# EAGLE schematic cft (EAGLE 5.11), part 4 of 7
## Sheet 29 of 49
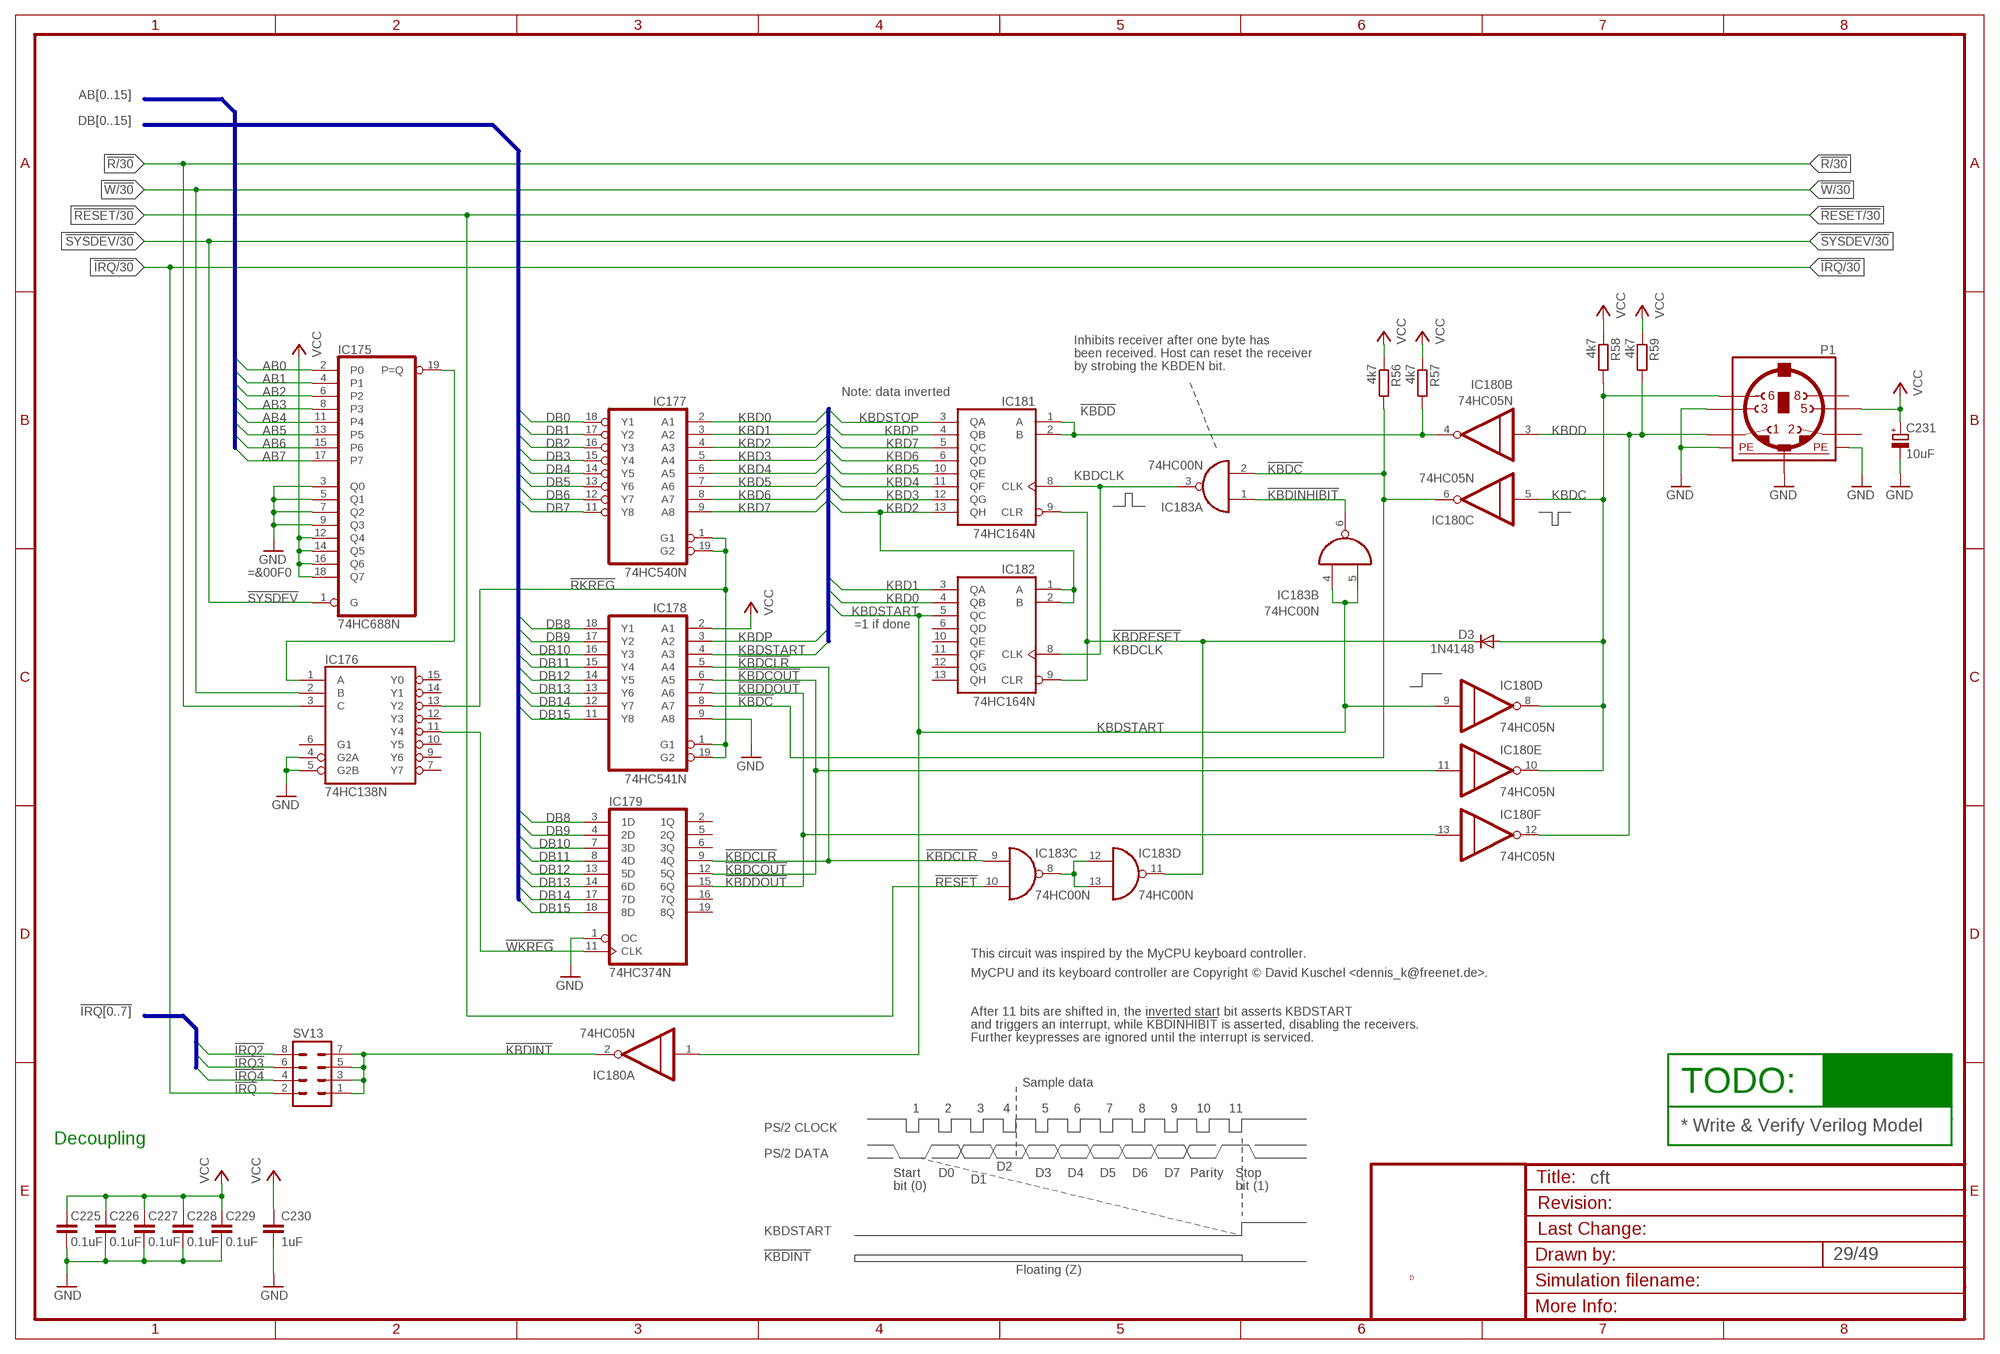
[diagram p28: schematic, sheet 29]

### Parts
C225  0.1uF  C-EU025-024X044  [C025-024X044]
C226  0.1uF  C-EU025-024X044  [C025-024X044]
C227  0.1uF  C-EU025-024X044  [C025-024X044]
C228  0.1uF  C-EU025-024X044  [C025-024X044]
C229  0.1uF  C-EU025-024X044  [C025-024X044]
C230  1uF  C-EU025-024X044  [C025-024X044]
C231  10uF  CPOL-EUE2.5-5  [E2,5-5]
D3  1N4148  1N4148DO35-7  [DO35-7]
IC175  74HC688N  [DIL20]
IC176  74HC138N  [DIL16]
IC177  74HC540N  [DIL20]
IC178  74HC541N  [DIL20]
IC179  74HC374N  [DIL20]
IC180  74HC05N  [DIL14]
IC181  74HC164N  [DIL14]
IC182  74HC164N  [DIL14]
IC183  74HC00N  [DIL14]
P1  MINI_DIN_6  [M_DIN6]
R56  4k7  R-EU_0204/7  [0204/7]
R57  4k7  R-EU_0204/7  [0204/7]
R58  4k7  R-EU_0204/7  [0204/7]
R59  4k7  R-EU_0204/7  [0204/7]
SV13  MA04-2  [MA04-2]

### Nets
!IRQ: SV13.2 ; also sheet 11,22,25,26,27,28,30,44,47
!IRQ2: SV13.8 ; also sheet 22,25,27,30,44,45,46,47
!IRQ3: SV13.6 ; also sheet 22,25,30,44,45,46,47
!IRQ4: SV13.4 ; also sheet 22,25,30,44,45,46,47
!KBDC: IC178.8(A7) IC180.6(C:O) IC183.2(A:I1) R56.2
!KBDCLR: IC178.5(A4) IC179.9(4Q) IC183.9(C:I0)
!KBDCOUT: IC178.6(A5) IC179.12(5Q) IC180.11(E:I)
!KBDD: IC180.4(B:O) IC181.1(A) IC181.2(B) R57.2
!KBDDOUT: IC178.7(A6) IC179.15(6Q) IC180.13(F:I)
!KBDINHIBIT: IC183.1(A:I0) IC183.6(B:O)
!KBDINT: IC180.2(A:O) SV13.1 SV13.3 SV13.5 SV13.7
!KBDRESET: D3.C IC181.9(CLR) IC182.9(CLR) IC183.11(D:O)
!R: IC176.3(C) ; also sheet 4,5,6,12,22,24,25,26,27,28,30,41,42,44,45,46,47,48
!RESET: IC183.10(C:I1) ; also sheet 2,3,4,7,8,10,11,12,13,14,17,18,19,20,21,22,25,26,28,30,31,44,45,46,47
!RKREG: IC176.13(Y2) IC177.1(G1) IC177.19(G2) IC178.1(G1) IC178.19(G2)
!SYSDEV: IC175.1(G) ; also sheet 13,21,22,25,26,27,28,30,41,44,45,46
!W: IC176.2(B) ; also sheet 12,21,22,24,25,26,27,28,30,41,44,45,46,47,48
!WKREG: IC176.11(Y4) IC179.11(CLK)
AB0: IC175.2(P0) ; also sheet 13,21,24,25,26,27,28,30,41,44,45,46,47,48
AB1: IC175.4(P1) ; also sheet 13,21,24,25,26,27,28,30,41,44,45,46,47,48
AB2: IC175.6(P2) ; also sheet 13,21,24,25,26,27,30,41,44,45,46,47,48
AB3: IC175.8(P3) ; also sheet 13,24,25,26,27,28,30,41,44,45,46,47,48
AB4: IC175.11(P4) ; also sheet 13,22,24,25,26,27,28,30,41,44,45,46,47,48
AB5: IC175.13(P5) ; also sheet 13,21,22,24,25,26,27,28,30,41,44,45,46,47,48
AB6: IC175.15(P6) ; also sheet 13,21,22,24,25,26,27,28,30,41,44,45,46,47,48
AB7: IC175.17(P7) ; also sheet 13,21,22,24,25,26,27,28,30,41,44,45,46,47,48
DB0: IC177.18(Y1) ; also sheet 12,21,22,24,25,26,27,28,30,31,41,44,45,46,47,48
DB1: IC177.17(Y2) ; also sheet 12,21,22,24,25,26,27,28,30,31,41,44,45,46,47,48
DB2: IC177.16(Y3) ; also sheet 12,21,22,24,25,26,27,28,30,31,41,44,45,46,47,48
DB3: IC177.15(Y4) ; also sheet 12,21,22,24,25,26,27,28,30,31,41,44,45,46,47,48
DB4: IC177.14(Y5) ; also sheet 12,21,22,24,25,26,27,28,30,31,41,44,45,46,47,48
DB5: IC177.13(Y6) ; also sheet 12,21,22,24,25,26,27,28,30,31,41,44,45,46,47,48
DB6: IC177.12(Y7) ; also sheet 12,21,22,24,25,26,27,28,30,31,41,44,45,46,47,48
DB7: IC177.11(Y8) ; also sheet 12,21,22,24,25,26,27,28,30,31,41,44,45,46,47,48
DB8: IC178.18(Y1) IC179.3(1D) ; also sheet 12,21,24,26,27,30,31,41,44,45,46,48
DB9: IC178.17(Y2) IC179.4(2D) ; also sheet 12,24,26,27,30,41,44,45,46,48
DB10: IC178.16(Y3) IC179.7(3D) ; also sheet 12,24,26,27,30,41,44,45,46,48
DB11: IC178.15(Y4) IC179.8(4D) ; also sheet 12,24,26,27,30,41,44,45,46,48
DB12: IC178.14(Y5) IC179.13(5D) ; also sheet 12,24,26,27,30,41,44,45,46,48
DB13: IC178.13(Y6) IC179.14(6D) ; also sheet 12,24,26,27,30,41,44,45,46,48
DB14: IC178.12(Y7) IC179.17(7D) ; also sheet 12,24,26,27,30,41,44,45,46,48
DB15: IC178.11(Y8) IC179.18(8D) ; also sheet 12,24,26,27,30,41,44,45,46,48
GND [low power]: C225.1 C226.1 C227.1 C228.1 C229.1 C230.2 C231.- IC175.3(Q0) IC175.5(Q1) IC175.7(Q2) IC175.9(Q3) IC176.4(G2A) IC176.5(G2B) IC178.9(A8) IC179.1(OC) P1.3 P1.SH1(PE1) P1.SH2(PE2) P1.SH3(PE3) ; also sheet 2,3,4,5,6,7,8,9,10,11,12,13,14,15,16,17,18,19,20,21,22,24,25,26,27,28,30,31,32,33,34,35,36,37,38,39,40,41,42,43,44,45,46,47,48,49
KBD0: IC177.2(A1) IC182.4(QB)
KBD1: IC177.3(A2) IC182.3(QA)
KBD2: IC177.4(A3) IC181.13(QH) IC182.1(A) IC182.2(B)
KBD3: IC177.5(A4) IC181.12(QG)
KBD4: IC177.6(A5) IC181.11(QF)
KBD5: IC177.7(A6) IC181.10(QE)
KBD6: IC177.8(A7) IC181.6(QD)
KBD7: IC177.9(A8) IC181.5(QC)
KBDC: D3.A IC180.5(C:I) IC180.8(D:O) IC180.10(E:O) P1.6 R58.2
KBDCLK: IC181.8(CLK) IC182.8(CLK) IC183.3(A:O)
KBDD: IC180.3(B:I) IC180.12(F:O) P1.1 R59.2
KBDP: IC178.3(A2) IC181.4(QB)
KBDSTART: IC178.4(A3) IC180.1(A:I) IC180.9(D:I) IC182.5(QC) IC183.4(B:I0) IC183.5(B:I1)
KBDSTOP: IC181.3(QA)
N$144: IC183.8(C:O) IC183.12(D:I0) IC183.13(D:I1)
N$145: IC175.19(P=Q) IC176.1(A)
VCC [low power]: C225.2 C226.2 C227.2 C228.2 C229.2 C230.1 C231.+ IC175.12(Q4) IC175.14(Q5) IC175.16(Q6) IC175.18(Q7) IC178.2(A1) P1.5 R56.1 R57.1 R58.1 R59.1 ; also sheet 2,3,4,6,7,8,9,10,11,12,13,14,15,16,17,18,19,20,21,22,24,25,26,27,28,30,31,34,35,36,37,38,39,40,41,42,43,44,45,46,47,48,49
Unconnected: IC176.6(G1) IC176.7(Y7) IC176.9(Y6) IC176.10(Y5) IC176.12(Y3) IC176.14(Y1) IC176.15(Y0) IC179.2(1Q) IC179.5(2Q) IC179.6(3Q) IC179.16(7Q) IC179.19(8Q) IC182.6(QD) IC182.10(QE) IC182.11(QF) IC182.12(QG) IC182.13(QH) P1.2 P1.8

### Buses
DB[0..15]
AB[0..15]
!IRQ[0..7]

### Notes on the sheet
- Inhibits receiver after one byte has
- been received. Host can reset the receiver
- by strobing the KBDEN bit.
- Note: data inverted
- =&00F0
- =1 if done
- This circuit was inspired by the MyCPU keyboard controller.
- MyCPU and its keyboard controller are Copyright © David Kuschel <dennis_k@freenet.de>.
- After 11 bits are shifted in, the inverted start bit asserts KBDSTART
- and triggers an interrupt, while !KBDINHIBIT! is asserted, disabling the receivers.
- Further keypresses are ignored until the interrupt is serviced.
- Sample data
- TODO:
- 1 | 2 | 3 | 4 | 5 | 6 | 7 | 8 | 9 | 10 | 11
- PS/2 CLOCK | * Write & Verify Verilog Model
- Decoupling
- PS/2 DATA
- D2
- Start | D0 | D3 | D4 | D5 | D6 | D7 | Parity | Stop
- D1
- bit (0) | bit (1)
- KBDSTART
- !KBDINT
- Floating (Z)
- D

## Sheet 30 of 49
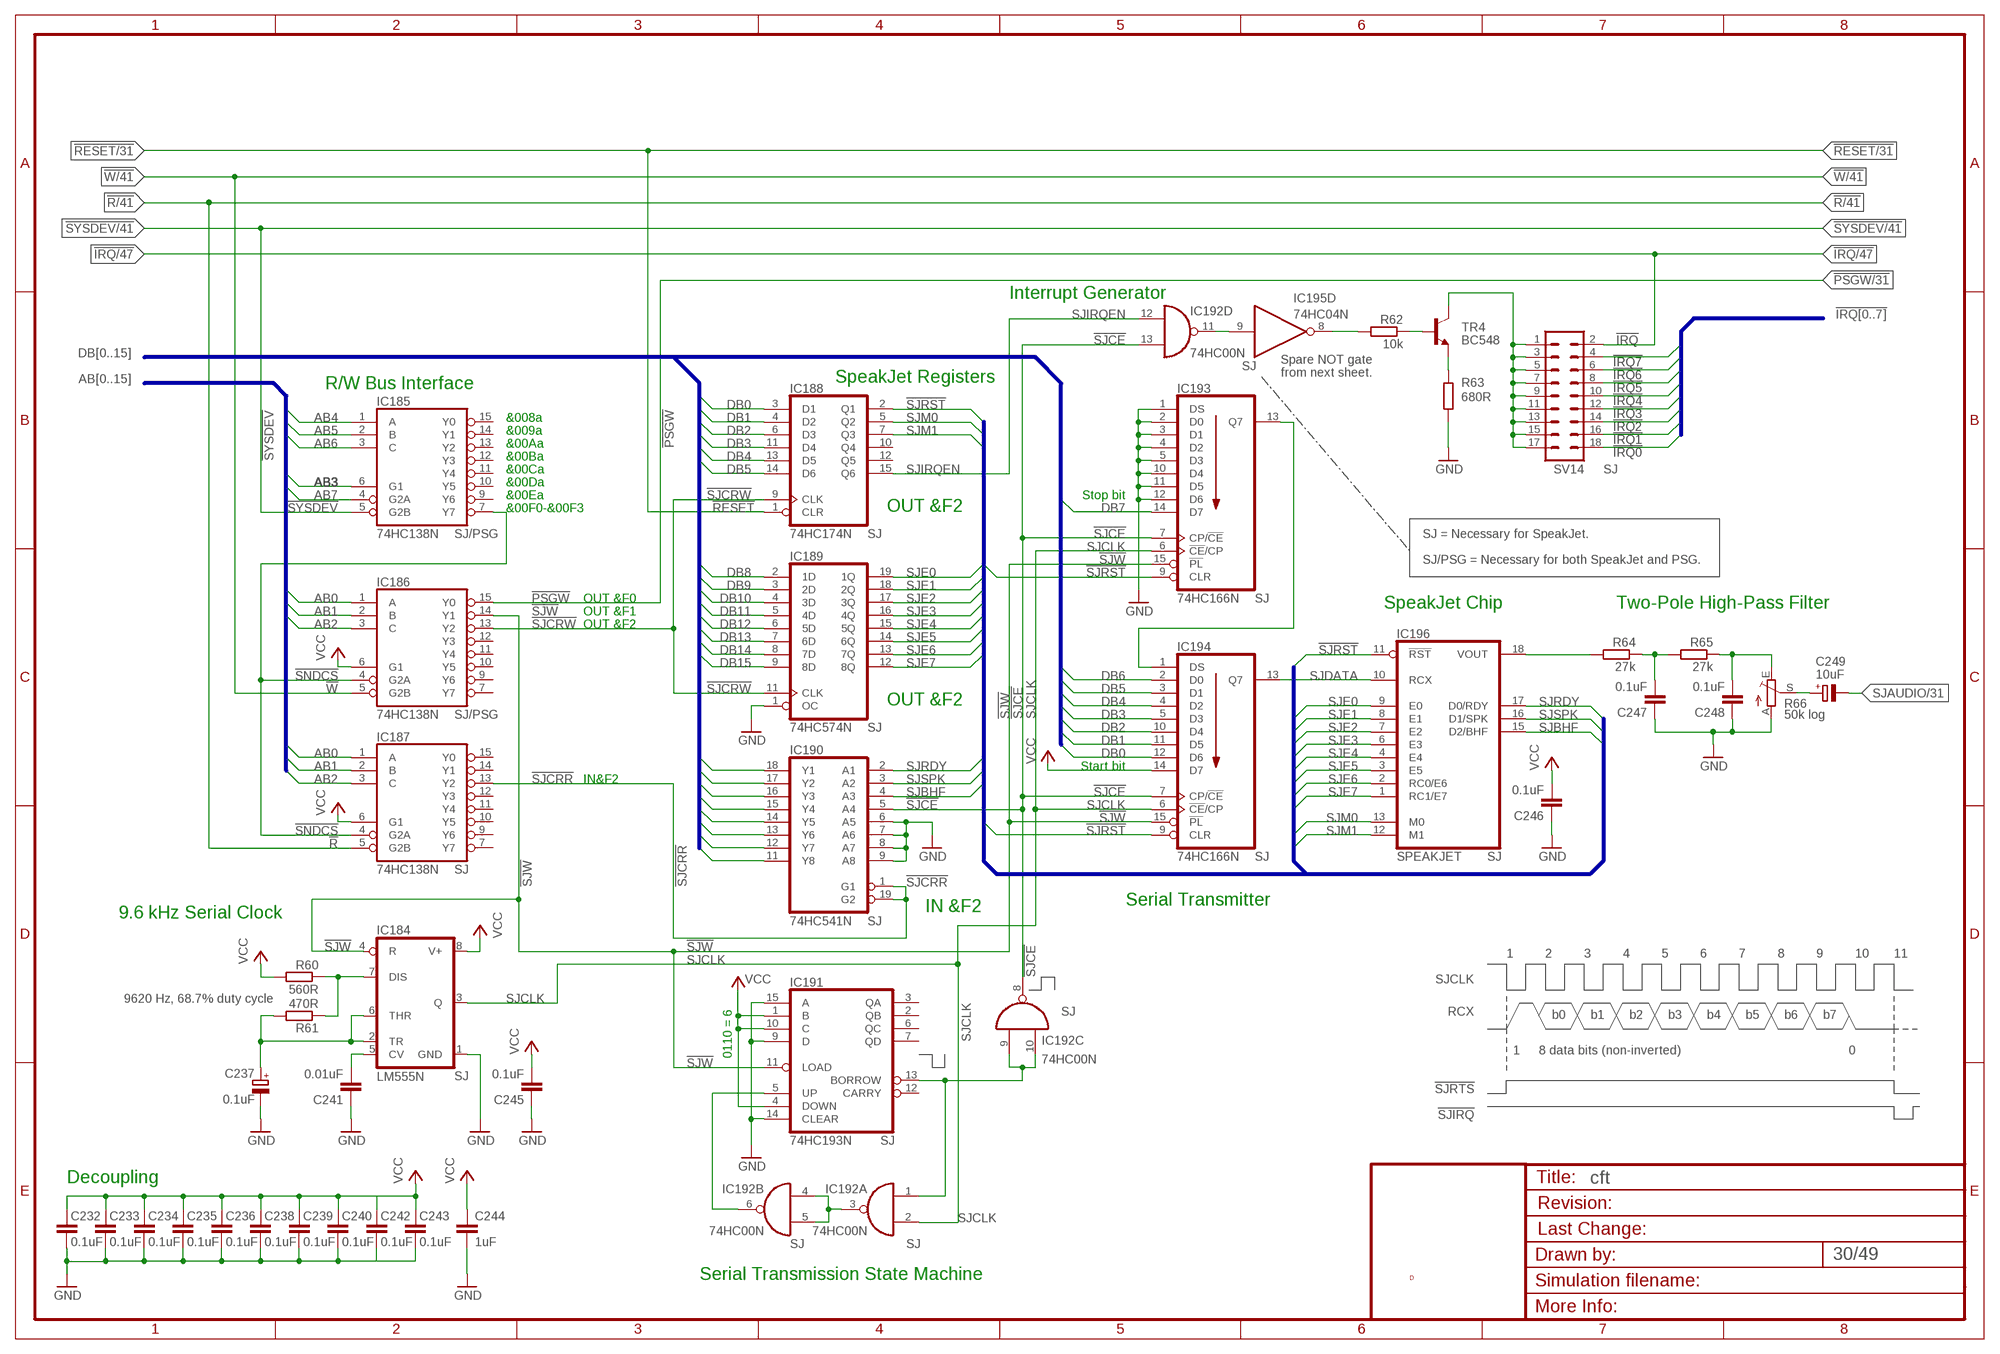
[diagram p29: schematic, sheet 30]

### Parts
C232  0.1uF  C-EU025-024X044  [C025-024X044]
C233  0.1uF  C-EU025-024X044  [C025-024X044]
C234  0.1uF  C-EU025-024X044  [C025-024X044]
C235  0.1uF  C-EU025-024X044  [C025-024X044]
C236  0.1uF  C-EU025-024X044  [C025-024X044]
C237  0.1uF  CPOL-EUE2.5-5  [E2,5-5]
C238  0.1uF  C-EU025-024X044  [C025-024X044]
C239  0.1uF  C-EU025-024X044  [C025-024X044]
C240  0.1uF  C-EU025-024X044  [C025-024X044]
C241  0.01uF  C-EU025-024X044  [C025-024X044]
C242  0.1uF  C-EU025-024X044  [C025-024X044]
C243  0.1uF  C-EU025-024X044  [C025-024X044]
C244  1uF  C-EU025-024X044  [C025-024X044]
C245  0.1uF  C-EU025-024X044  [C025-024X044]
C246  0.1uF  C-EU025-024X044  [C025-024X044]
C247  0.1uF  C-EU025-024X044  [C025-024X044]
C248  0.1uF  C-EU025-024X044  [C025-024X044]
C249  10uF  CPOL-EUE2.5-5  [E2,5-5]
IC184  LM555N  [DIL08]
IC185  74HC138N  [DIL16]
IC186  74HC138N  [DIL16]
IC187  74HC138N  [DIL16]
IC188  74HC174N  [DIL16]
IC189  74HC574N  [DIL20]
IC190  74HC541N  [DIL20]
IC191  74HC193N  [DIL16]
IC192  74HC00N  [DIL14]
IC193  74HC166N  [DIL16]
IC194  74HC166N  [DIL16]
IC195  74HC04N  [DIL14]
IC196  SPEAKJET  [DIL18]
R60  560R  R-EU_0204/7  [0204/7]
R61  470R  R-EU_0204/7  [0204/7]
R62  10k  R-EU_0204/7  [0204/7]
R63  680R  R-EU_0204/7  [0204/7]
R64  27k  R-EU_0204/7  [0204/7]
R65  27k  R-EU_0204/7  [0204/7]
R66  50k log  TRIM_EU-CT6  [CT6]
SV14  MA09-2  [MA09-2]
TR4  BC548  [TO92-EBC]

### Nets
!IRQ: SV14.2 ; also sheet 11,22,25,26,27,28,29,44,47
!IRQ0: SV14.18 ; also sheet 22,25,27,44,45,46
!IRQ1: SV14.16 ; also sheet 22,25,27,44,45,46
!IRQ2: SV14.14 ; also sheet 22,25,27,29,44,45,46,47
!IRQ3: SV14.12 ; also sheet 22,25,29,44,45,46,47
!IRQ4: SV14.10 ; also sheet 22,25,29,44,45,46,47
!IRQ5: SV14.8 ; also sheet 22,25,26,28,44,45,46
!IRQ6: SV14.6 ; also sheet 22,25,26,28,44,45,46
!IRQ7: SV14.4 ; also sheet 22,25,26,28,44,45,46
!PSGW: IC186.15(Y0) ; also sheet 31
!R: IC187.5(G2B) ; also sheet 4,5,6,12,22,24,25,26,27,28,29,41,42,44,45,46,47,48
!RESET: IC188.1(CLR) ; also sheet 2,3,4,7,8,10,11,12,13,14,17,18,19,20,21,22,25,26,28,29,31,44,45,46,47
!SJCE: IC190.5(A4) IC192.8(C:O) IC192.13(D:I1) IC193.7(CP/!CE!) IC194.7(CP/!CE!)
!SJCRR: IC187.13(Y2) IC190.1(G1) IC190.19(G2)
!SJCRW: IC186.13(Y2) IC188.9(CLK) IC189.11(CLK)
!SJRST: IC188.2(Q1) IC193.9(CLR) IC194.9(CLR) IC196.11(!RST)
!SJW: IC184.4(R) IC186.14(Y1) IC191.11(LOAD) IC193.15(!PL) IC194.15(!PL)
!SNDCS: IC185.7(Y7) IC186.4(G2A) IC187.4(G2A)
!SYSDEV: IC185.5(G2B) ; also sheet 13,21,22,25,26,27,28,29,41,44,45,46
!W: IC186.5(G2B) ; also sheet 12,21,22,24,25,26,27,28,29,41,44,45,46,47,48
AB0: IC186.1(A) IC187.1(A) ; also sheet 13,21,24,25,26,27,28,29,41,44,45,46,47,48
AB1: IC186.2(B) IC187.2(B) ; also sheet 13,21,24,25,26,27,28,29,41,44,45,46,47,48
AB2: IC186.3(C) IC187.3(C) ; also sheet 13,21,24,25,26,27,29,41,44,45,46,47,48
AB3: IC185.6(G1) ; also sheet 13,24,25,26,27,28,29,41,44,45,46,47,48
AB4: IC185.1(A) ; also sheet 13,22,24,25,26,27,28,29,41,44,45,46,47,48
AB5: IC185.2(B) ; also sheet 13,21,22,24,25,26,27,28,29,41,44,45,46,47,48
AB6: IC185.3(C) ; also sheet 13,21,22,24,25,26,27,28,29,41,44,45,46,47,48
AB7: IC185.4(G2A) ; also sheet 13,21,22,24,25,26,27,28,29,41,44,45,46,47,48
DB0: IC188.3(D1) IC190.18(Y1) IC194.12(D6) ; also sheet 12,21,22,24,25,26,27,28,29,31,41,44,45,46,47,48
DB1: IC188.4(D2) IC190.17(Y2) IC194.11(D5) ; also sheet 12,21,22,24,25,26,27,28,29,31,41,44,45,46,47,48
DB2: IC188.6(D3) IC190.16(Y3) IC194.10(D4) ; also sheet 12,21,22,24,25,26,27,28,29,31,41,44,45,46,47,48
DB3: IC188.11(D4) IC190.15(Y4) IC194.5(D3) ; also sheet 12,21,22,24,25,26,27,28,29,31,41,44,45,46,47,48
DB4: IC188.13(D5) IC190.14(Y5) IC194.4(D2) ; also sheet 12,21,22,24,25,26,27,28,29,31,41,44,45,46,47,48
DB5: IC188.14(D6) IC190.13(Y6) IC194.3(D1) ; also sheet 12,21,22,24,25,26,27,28,29,31,41,44,45,46,47,48
DB6: IC190.12(Y7) IC194.2(D0) ; also sheet 12,21,22,24,25,26,27,28,29,31,41,44,45,46,47,48
DB7: IC190.11(Y8) IC193.14(D7) ; also sheet 12,21,22,24,25,26,27,28,29,31,41,44,45,46,47,48
DB8: IC189.2(1D) ; also sheet 12,21,24,26,27,29,31,41,44,45,46,48
DB9: IC189.3(2D) ; also sheet 12,24,26,27,29,41,44,45,46,48
DB10: IC189.4(3D) ; also sheet 12,24,26,27,29,41,44,45,46,48
DB11: IC189.5(4D) ; also sheet 12,24,26,27,29,41,44,45,46,48
DB12: IC189.6(5D) ; also sheet 12,24,26,27,29,41,44,45,46,48
DB13: IC189.7(6D) ; also sheet 12,24,26,27,29,41,44,45,46,48
DB14: IC189.8(7D) ; also sheet 12,24,26,27,29,41,44,45,46,48
DB15: IC189.9(8D) ; also sheet 12,24,26,27,29,41,44,45,46,48
GND [low power]: C232.1 C233.1 C234.1 C235.1 C236.1 C237.- C238.1 C239.1 C240.1 C241.1 C242.1 C243.1 C244.2 C245.1 C246.1 C247.1 C248.1 IC184.1(GND) IC189.1(OC) IC190.6(A5) IC190.7(A6) IC190.8(A7) IC190.9(A8) IC191.9(D) IC191.14(CLEAR) IC191.15(A) IC193.1(DS) IC193.2(D0) IC193.3(D1) IC193.4(D2) IC193.5(D3) IC193.10(D4) IC193.11(D5) IC193.12(D6) R63.2 R66.A ; also sheet 2,3,4,5,6,7,8,9,10,11,12,13,14,15,16,17,18,19,20,21,22,24,25,26,27,28,29,31,32,33,34,35,36,37,38,39,40,41,42,43,44,45,46,47,48,49
N$87: IC193.13(Q7) IC194.1(DS)
N$387: IC192.11(D:O) IC195.9(D:I)
N$388: R62.1 TR4.B
N$419: R63.1 TR4.E
N$423: C241.2 IC184.5(CV)
N$424: C237.+ IC184.2(TR) IC184.6(THR) R61.2
N$425: IC196.18(VOUT) R64.2
N$442: IC184.7(DIS) R60.1 R61.1
N$443: IC191.5(UP) IC192.6(B:O)
N$444: C247.2 R64.1 R65.2
N$445: IC191.13(BORROW) IC192.1(A:I0) IC192.9(C:I0) IC192.10(C:I1)
N$446: IC192.3(A:O) IC192.4(B:I0) IC192.5(B:I1)
N$447: C248.2 R65.1 R66.E
N$448: C249.+ R66.S
N$452: IC195.8(D:O) R62.2
N$453 [low power]: SV14.1 SV14.3 SV14.5 SV14.7 SV14.9 SV14.11 SV14.13 SV14.15 SV14.17 TR4.C
SJAUDIO: C249.- ; also sheet 31
SJBHF: IC190.4(A3) IC196.15(D2/BHF)
SJCLK: IC184.3(Q) IC192.2(A:I1) IC193.6(!CE!/CP) IC194.6(!CE!/CP)
SJDATA: IC194.13(Q7) IC196.10(RCX)
SJE0: IC189.19(1Q) IC196.9(E0)
SJE1: IC189.18(2Q) IC196.8(E1)
SJE2: IC189.17(3Q) IC196.7(E2)
SJE3: IC189.16(4Q) IC196.6(E3)
SJE4: IC189.15(5Q) IC196.4(E4)
SJE5: IC189.14(6Q) IC196.3(E5)
SJE6: IC189.13(7Q) IC196.2(RC0/E6)
SJE7: IC189.12(8Q) IC196.1(RC1/E7)
SJIRQEN: IC188.15(Q6) IC192.12(D:I0)
SJM0: IC188.5(Q2) IC196.13(M0)
SJM1: IC188.7(Q3) IC196.12(M1)
SJRDY: IC190.2(A1) IC196.17(D0/RDY)
SJSPK: IC190.3(A2) IC196.16(D1/SPK)
VCC [low power]: C232.2 C233.2 C234.2 C235.2 C236.2 C238.2 C239.2 C240.2 C242.2 C243.2 C244.1 C245.2 C246.2 IC184.8(V+) IC186.6(G1) IC187.6(G1) IC191.1(B) IC191.4(DOWN) IC191.10(C) IC194.14(D7) R60.2 ; also sheet 2,3,4,6,7,8,9,10,11,12,13,14,15,16,17,18,19,20,21,22,24,25,26,27,28,29,31,34,35,36,37,38,39,40,41,42,43,44,45,46,47,48,49
Unconnected: IC185.9(Y6) IC185.10(Y5) IC185.11(Y4) IC185.12(Y3) IC185.13(Y2) IC185.14(Y1) IC185.15(Y0) IC186.7(Y7) IC186.9(Y6) IC186.10(Y5) IC186.11(Y4) IC186.12(Y3) IC187.7(Y7) IC187.9(Y6) IC187.10(Y5) IC187.11(Y4) IC187.12(Y3) IC187.14(Y1) IC187.15(Y0) IC188.10(Q4) IC188.12(Q5) IC191.2(QB) IC191.3(QA) IC191.6(QC) IC191.7(QD) IC191.12(CARRY)

### Buses
DB[0..15]
AB[0..15]
SJE[0..7],SJM[0..1],!SJRST,SJRDY,SJSPK,SJBHF
!IRQ[0..7]

### Notes on the sheet
- Interrupt Generator
- Spare NOT gate
- SJ
- from next sheet.
- SpeakJet Registers
- R/W Bus Interface
- &008a
- &009a
- &00Aa
- &00Ba
- &00Ca | SJ
- &00Da
- &00Ea | Stop bit
- &00F0-&00F3 | OUT &F2
- SJ/PSG | SJ | SJ = Necessary for SpeakJet.
- SJ/PSG = Necessary for both SpeakJet and PSG.
- OUT &F0 | SJ
- SpeakJet Chip | Two-Pole High-Pass Filter
- OUT &F1
- OUT &F2
- OUT &F2
- SJ/PSG
- SJ
- Start bit
- IN&F2
- SJ | SJ
- SJ
- Serial Transmitter
- IN &F2
- 9.6 kHz Serial Clock
- SJ
- 1 | 2 | 3 | 4 | 5 | 6 | 7 | 8 | 9 | 10 | 11
- SJCLK
- 9620 Hz, 68.7% duty cycle
- 0110 = 6
- SJ | RCX | b0 | b1 | b2 | b3 | b4 | b5 | b6 | b7
- 1 | 8 data bits (non-inverted) | 0
- SJ
- !SJRTS
- !SJIRQ
- SJ
- Decoupling
- SJ | SJ
- Serial Transmission State Machine | D

## Sheet 31 of 49
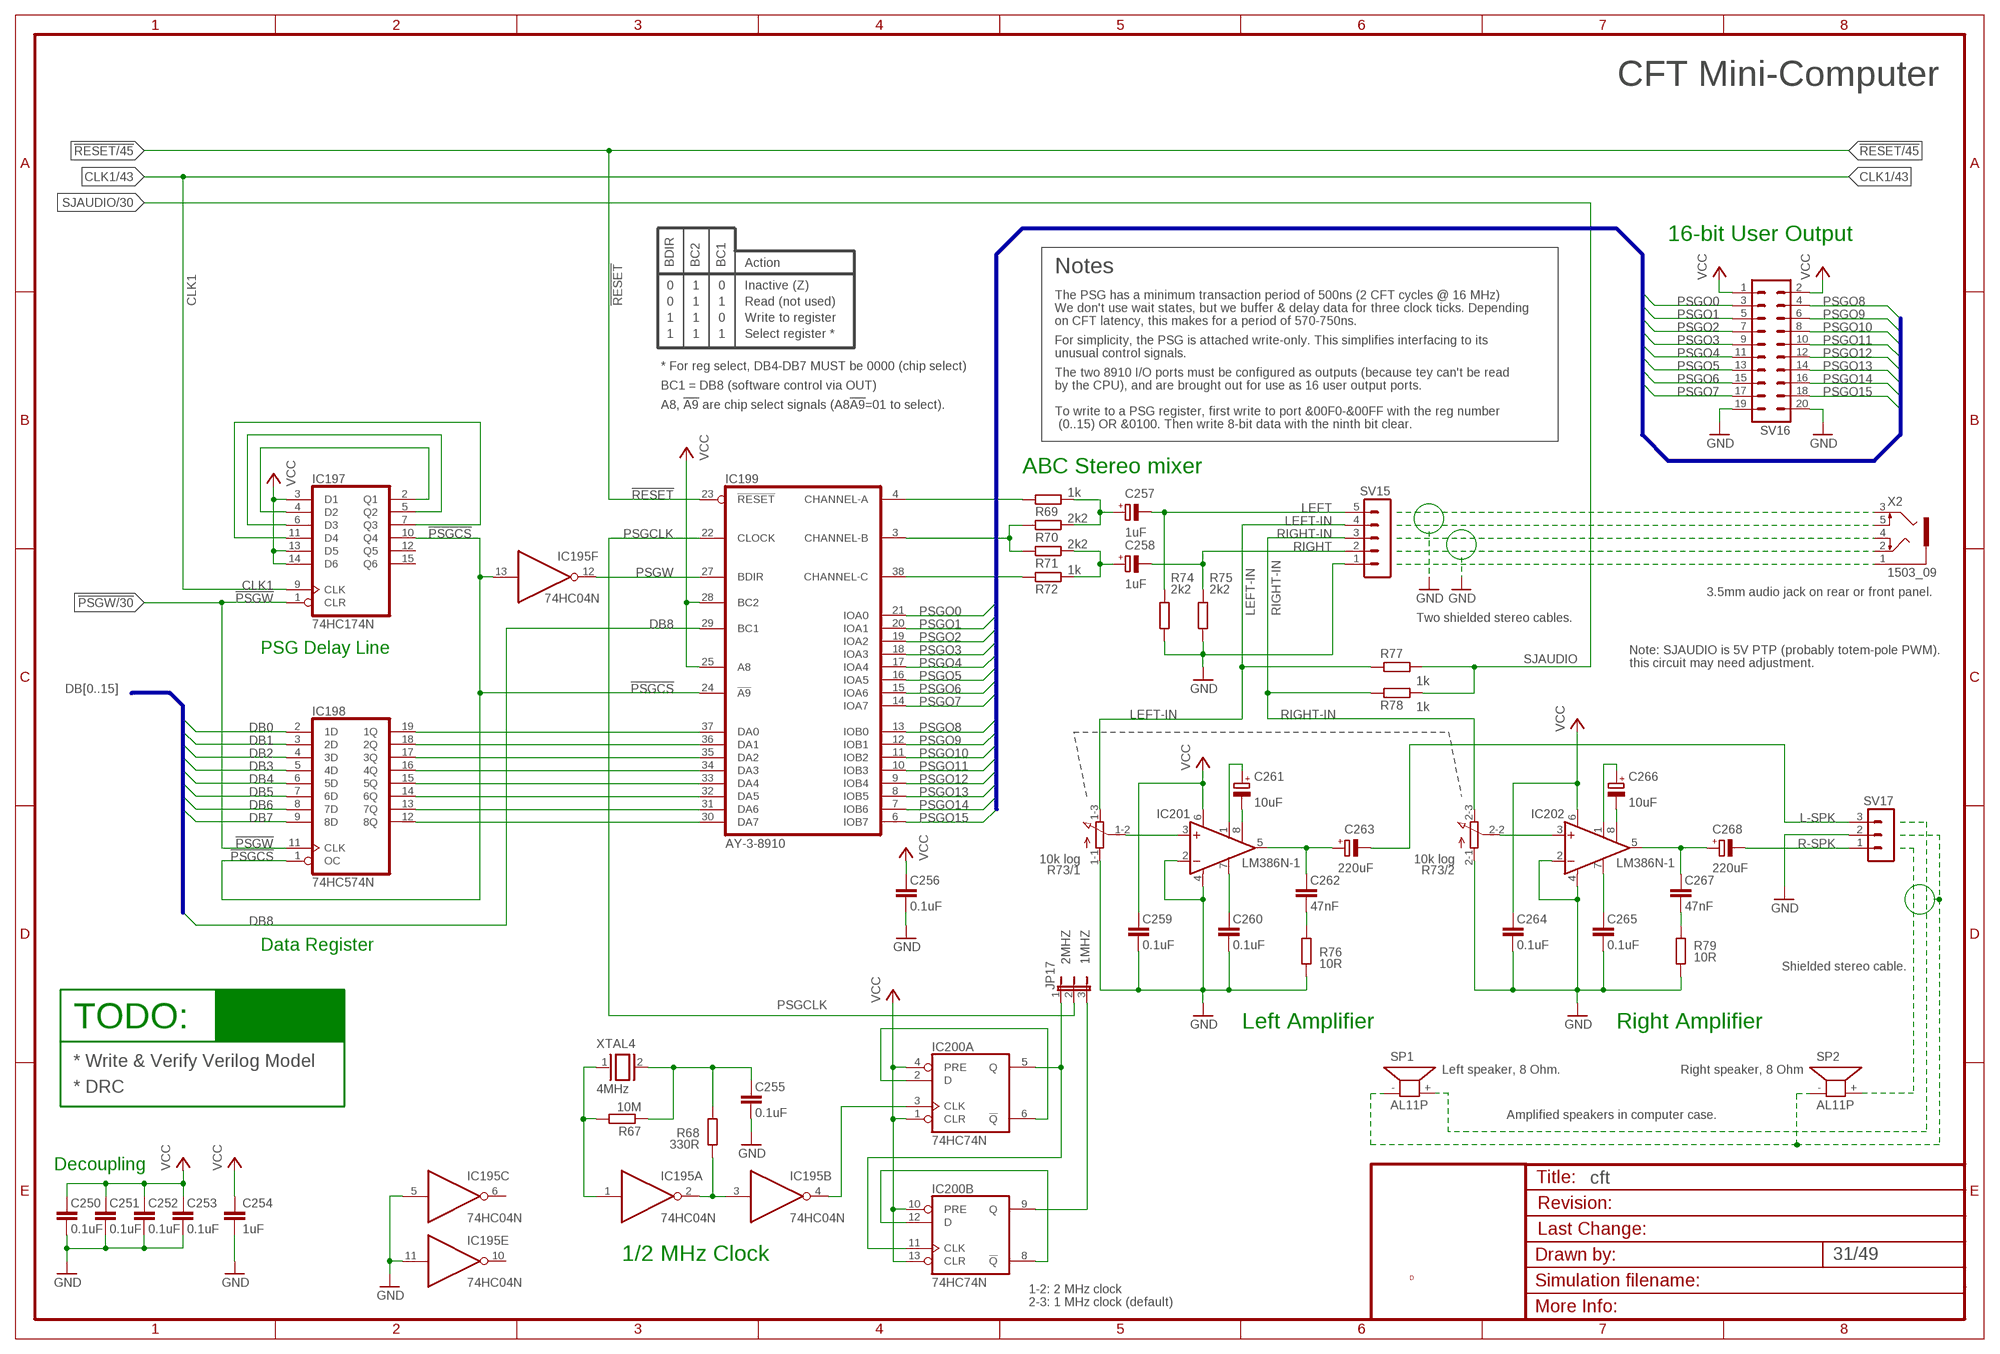
[diagram p30: schematic, sheet 31]

### Parts
C250  0.1uF  C-EU025-024X044  [C025-024X044]
C251  0.1uF  C-EU025-024X044  [C025-024X044]
C252  0.1uF  C-EU025-024X044  [C025-024X044]
C253  0.1uF  C-EU025-024X044  [C025-024X044]
C254  1uF  C-EU025-024X044  [C025-024X044]
C255  0.1uF  C-EU025-024X044  [C025-024X044]
C256  0.1uF  C-EU025-024X044  [C025-024X044]
C257  1uF  CPOL-EUE2.5-5  [E2,5-5]
C258  1uF  CPOL-EUE2.5-5  [E2,5-5]
C259  0.1uF  C-EU025-024X044  [C025-024X044]
C260  0.1uF  C-EU025-024X044  [C025-024X044]
C261  10uF  CPOL-EUE2.5-5  [E2,5-5]
C262  47nF  C-EU025-024X044  [C025-024X044]
C263  220uF  CPOL-EUE2.5-5  [E2,5-5]
C264  0.1uF  C-EU025-024X044  [C025-024X044]
C265  0.1uF  C-EU025-024X044  [C025-024X044]
C266  10uF  CPOL-EUE2.5-5  [E2,5-5]
C267  47nF  C-EU025-024X044  [C025-024X044]
C268  220uF  CPOL-EUE2.5-5  [E2,5-5]
IC197  74HC174N  [DIL16]
IC198  74HC574N  [DIL20]
IC199  AY-3-8910  [DIL40]
IC200  74HC74N  [DIL14]
IC201  LM386N-1  [DIL08]
IC202  LM386N-1  [DIL08]
JP17  JP2E  [JP2]
R67  10M  R-EU_0204/7  [0204/7]
R68  330R  R-EU_0204/7  [0204/7]
R69  1k  R-EU_0204/7  [0204/7]
R70  2k2  R-EU_0204/7  [0204/7]
R71  2k2  R-EU_0204/7  [0204/7]
R72  1k  R-EU_0204/7  [0204/7]
R73  10k log  3RP/1610G  [3RP/1610G]
R74  2k2  R-EU_0204/7  [0204/7]
R75  2k2  R-EU_0204/7  [0204/7]
R76  10R  R-EU_0204/7  [0204/7]
R77  1k  R-EU_0204/7  [0204/7]
R78  1k  R-EU_0204/7  [0204/7]
R79  10R  R-EU_0204/7  [0204/7]
SP1  AL11P  [AL11P]
SP2  AL11P  [AL11P]
SV15  MA05-1  [MA05-1]
SV16  MA10-2  [MA10-2]
SV17  MA03-1  [MA03-1]
X2  1503_09  [1503_09]
XTAL4  4MHz  XTAL/S  [QS]

### Nets
1MHZ: IC200.9(B:Q) JP17.3
2MHZ: IC200.5(A:Q) IC200.11(B:CLK) JP17.1
!PSGCS: IC195.13(F:I) IC197.10(Q4) IC198.1(OC) IC199.24(!A9)
!PSGW: IC197.1(CLR) IC198.11(CLK) ; also sheet 30
!RESET: IC199.23(!RESET) ; also sheet 2,3,4,7,8,10,11,12,13,14,17,18,19,20,21,22,25,26,28,29,30,44,45,46,47
CLK1: IC197.9(CLK) ; also sheet 2,7,27,43,44,45,46
DB0: IC198.2(1D) ; also sheet 12,21,22,24,25,26,27,28,29,30,41,44,45,46,47,48
DB1: IC198.3(2D) ; also sheet 12,21,22,24,25,26,27,28,29,30,41,44,45,46,47,48
DB2: IC198.4(3D) ; also sheet 12,21,22,24,25,26,27,28,29,30,41,44,45,46,47,48
DB3: IC198.5(4D) ; also sheet 12,21,22,24,25,26,27,28,29,30,41,44,45,46,47,48
DB4: IC198.6(5D) ; also sheet 12,21,22,24,25,26,27,28,29,30,41,44,45,46,47,48
DB5: IC198.7(6D) ; also sheet 12,21,22,24,25,26,27,28,29,30,41,44,45,46,47,48
DB6: IC198.8(7D) ; also sheet 12,21,22,24,25,26,27,28,29,30,41,44,45,46,47,48
DB7: IC198.9(8D) ; also sheet 12,21,22,24,25,26,27,28,29,30,41,44,45,46,47,48
DB8: IC199.29(BC1) ; also sheet 12,21,24,26,27,29,30,41,44,45,46,48
GND [low power]: C250.1 C251.1 C252.1 C253.1 C254.2 C255.1 C256.1 C259.1 C260.1 C264.1 C265.1 IC195.5(C:I) IC195.11(E:I) IC201.2(-IN) IC201.4(GND) IC202.2(-IN) IC202.4(GND) R73.1-1(/1:A) R73.2-1(/2:A) R74.2 R75.2 R76.2 R79.2 SV15.1 SV16.19 SV16.20 SV17.2 ; also sheet 2,3,4,5,6,7,8,9,10,11,12,13,14,15,16,17,18,19,20,21,22,24,25,26,27,28,29,30,32,33,34,35,36,37,38,39,40,41,42,43,44,45,46,47,48,49
L-SPK: C263.- SV17.3
LEFT: C257.- R74.1 SV15.5
LEFT-IN: R73.1-3(/1:E) R77.2 SV15.4
N$29: IC199.4(CHANNEL-A) R69.2
N$30: IC199.3(CHANNEL-B) R70.2 R71.2
N$35: C257.+ R69.1 R70.1
N$37: IC199.38(CHANNEL-C) R72.2
N$46: C258.+ R71.1 R72.1
N$47: C265.2 IC202.7(BYPASS)
N$48: C267.1 R79.1
N$49: C261.- IC201.8(GAIN)
N$50: C261.+ IC201.1(GAIN)
N$80: C260.2 IC201.7(BYPASS)
N$81: IC198.12(8Q) IC199.30(DA7)
N$83: X2.3
N$84: IC198.13(7Q) IC199.31(DA6)
N$85: C262.1 R76.1
N$86: C262.2 C263.+ IC201.5(OUT)
N$88: IC201.3(+IN) R73.1-2(/1:S)
N$91: X2.5
N$92: C267.2 C268.+ IC202.5(OUT)
N$146: IC202.3(+IN) R73.2-2(/2:S)
N$148: C266.- IC202.8(GAIN)
N$149: C266.+ IC202.1(GAIN)
N$191: X2.4
N$194: X2.2
N$259: X2.1
N$350: SP1.+
N$351: SP2.+
N$352: SP1.- SP2.-
N$361: IC195.1(A:I) R67.2 XTAL4.1
N$362: IC195.2(A:O) IC195.3(B:I) R68.2
N$363: C255.2 R67.1 R68.1 XTAL4.2
N$364: IC195.4(B:O) IC200.3(A:CLK)
N$365: IC198.14(6Q) IC199.32(DA5)
N$367: IC200.2(A:D) IC200.6(A:!Q)
N$368: IC200.8(B:!Q) IC200.12(B:D)
N$374: IC198.15(5Q) IC199.33(DA4)
N$380: IC198.16(4Q) IC199.34(DA3)
N$383: IC198.17(3Q) IC199.35(DA2)
N$384: IC198.18(2Q) IC199.36(DA1)
N$386: IC198.19(1Q) IC199.37(DA0)
N$420: IC197.2(Q1) IC197.4(D2)
N$421: IC197.5(Q2) IC197.6(D3)
N$422: IC197.7(Q3) IC197.11(D4)
PSGCLK: IC199.22(CLOCK) JP17.2
PSGO0: IC199.21(IOA0)
PSGO1: IC199.20(IOA1)
PSGO2: IC199.19(IOA2)
PSGO3: IC199.18(IOA3)
PSGO4: IC199.17(IOA4)
PSGO5: IC199.16(IOA5)
PSGO6: IC199.15(IOA6)
PSGO7: IC199.14(IOA7)
PSGO8: IC199.13(IOB0) SV16.4
PSGO9: IC199.12(IOB1) SV16.6
PSGO10: IC199.11(IOB2) SV16.8
PSGO11: IC199.10(IOB3) SV16.10
PSGO12: IC199.9(IOB4) SV16.12
PSGO13: IC199.8(IOB5) SV16.14
PSGO14: IC199.7(IOB6) SV16.16
PSGO15: IC199.6(IOB7) SV16.18
PSGW: IC195.12(F:O) IC199.27(BDIR)
R-SPK: C268.- SV17.1
RIGHT: C258.- R75.1 SV15.2
RIGHT-IN: R73.2-3(/2:E) R78.2 SV15.3
SJAUDIO: R77.1 R78.1 ; also sheet 30
VCC [low power]: C250.2 C251.2 C252.2 C253.2 C254.1 C256.2 C259.2 C264.2 IC197.3(D1) IC197.13(D5) IC197.14(D6) IC199.25(A8) IC199.28(BC2) IC200.1(A:CLR) IC200.4(A:PRE) IC200.10(B:PRE) IC200.13(B:CLR) IC201.6(VS) IC202.6(VS) SV16.1 SV16.2 ; also sheet 2,3,4,6,7,8,9,10,11,12,13,14,15,16,17,18,19,20,21,22,24,25,26,27,28,29,30,34,35,36,37,38,39,40,41,42,43,44,45,46,47,48,49
Unconnected: IC195.6(C:O) IC195.10(E:O) IC197.12(Q5) IC197.15(Q6) SV16.3 SV16.5 SV16.7 SV16.9 SV16.11 SV16.13 SV16.15 SV16.17

### Buses
DB[0..15]
PSGO[0..15]

### Notes on the sheet
- CFT Mini-Computer
- 16-bit User Output
- BDIR | BC2 | BC1 | Action
- Notes
- 0 | 1 | 0 | Inactive (Z)
- The PSG has a minimum transaction period of 500ns (2 CFT cycles @ 16 MHz)
- 0 | 1 | 1 | Read (not used)
- We don't use wait states, but we buffer & delay data for three clock ticks. Depending
- 1 | 1 | 0 | Write to register | on CFT latency, this makes for a period of 570-750ns.
- 1 | 1 | 1 | Select register *
- For simplicity, the PSG is attached write-only. This simplifies interfacing to its
- unusual control signals.
- * For reg select, DB4-DB7 MUST be 0000 (chip select)
- The two 8910 I/O ports must be configured as outputs (because tey can't be read
- BC1 = DB8 (software control via OUT) | by the CPU), and are brought out for use as 16 user output ports.
- A8, !A9! are chip select signals (A8!A9!=01 to select).
- To write to a PSG register, first write to port &00F0-&00FF with the reg number
- (0..15) OR &0100. Then write 8-bit data with the ninth bit clear.
- ABC Stereo mixer
- 3.5mm audio jack on rear or front panel.
- Two shielded stereo cables.
- PSG Delay Line | Note: SJAUDIO is 5V PTP (probably totem-pole PWM).
- this circuit may need adjustment.
- Data Register
- Shielded stereo cable.
- TODO: | Left Amplifier | Right Amplifier
- * Write & Verify Verilog Model
- Left speaker, 8 Ohm. | Right speaker, 8 Ohm
- * DRC
- Amplified speakers in computer case.
- Decoupling
- 1/2 MHz Clock
- D
- 1-2: 2 MHz clock
- 2-3: 1 MHz clock (default)

## Sheet 32 of 49
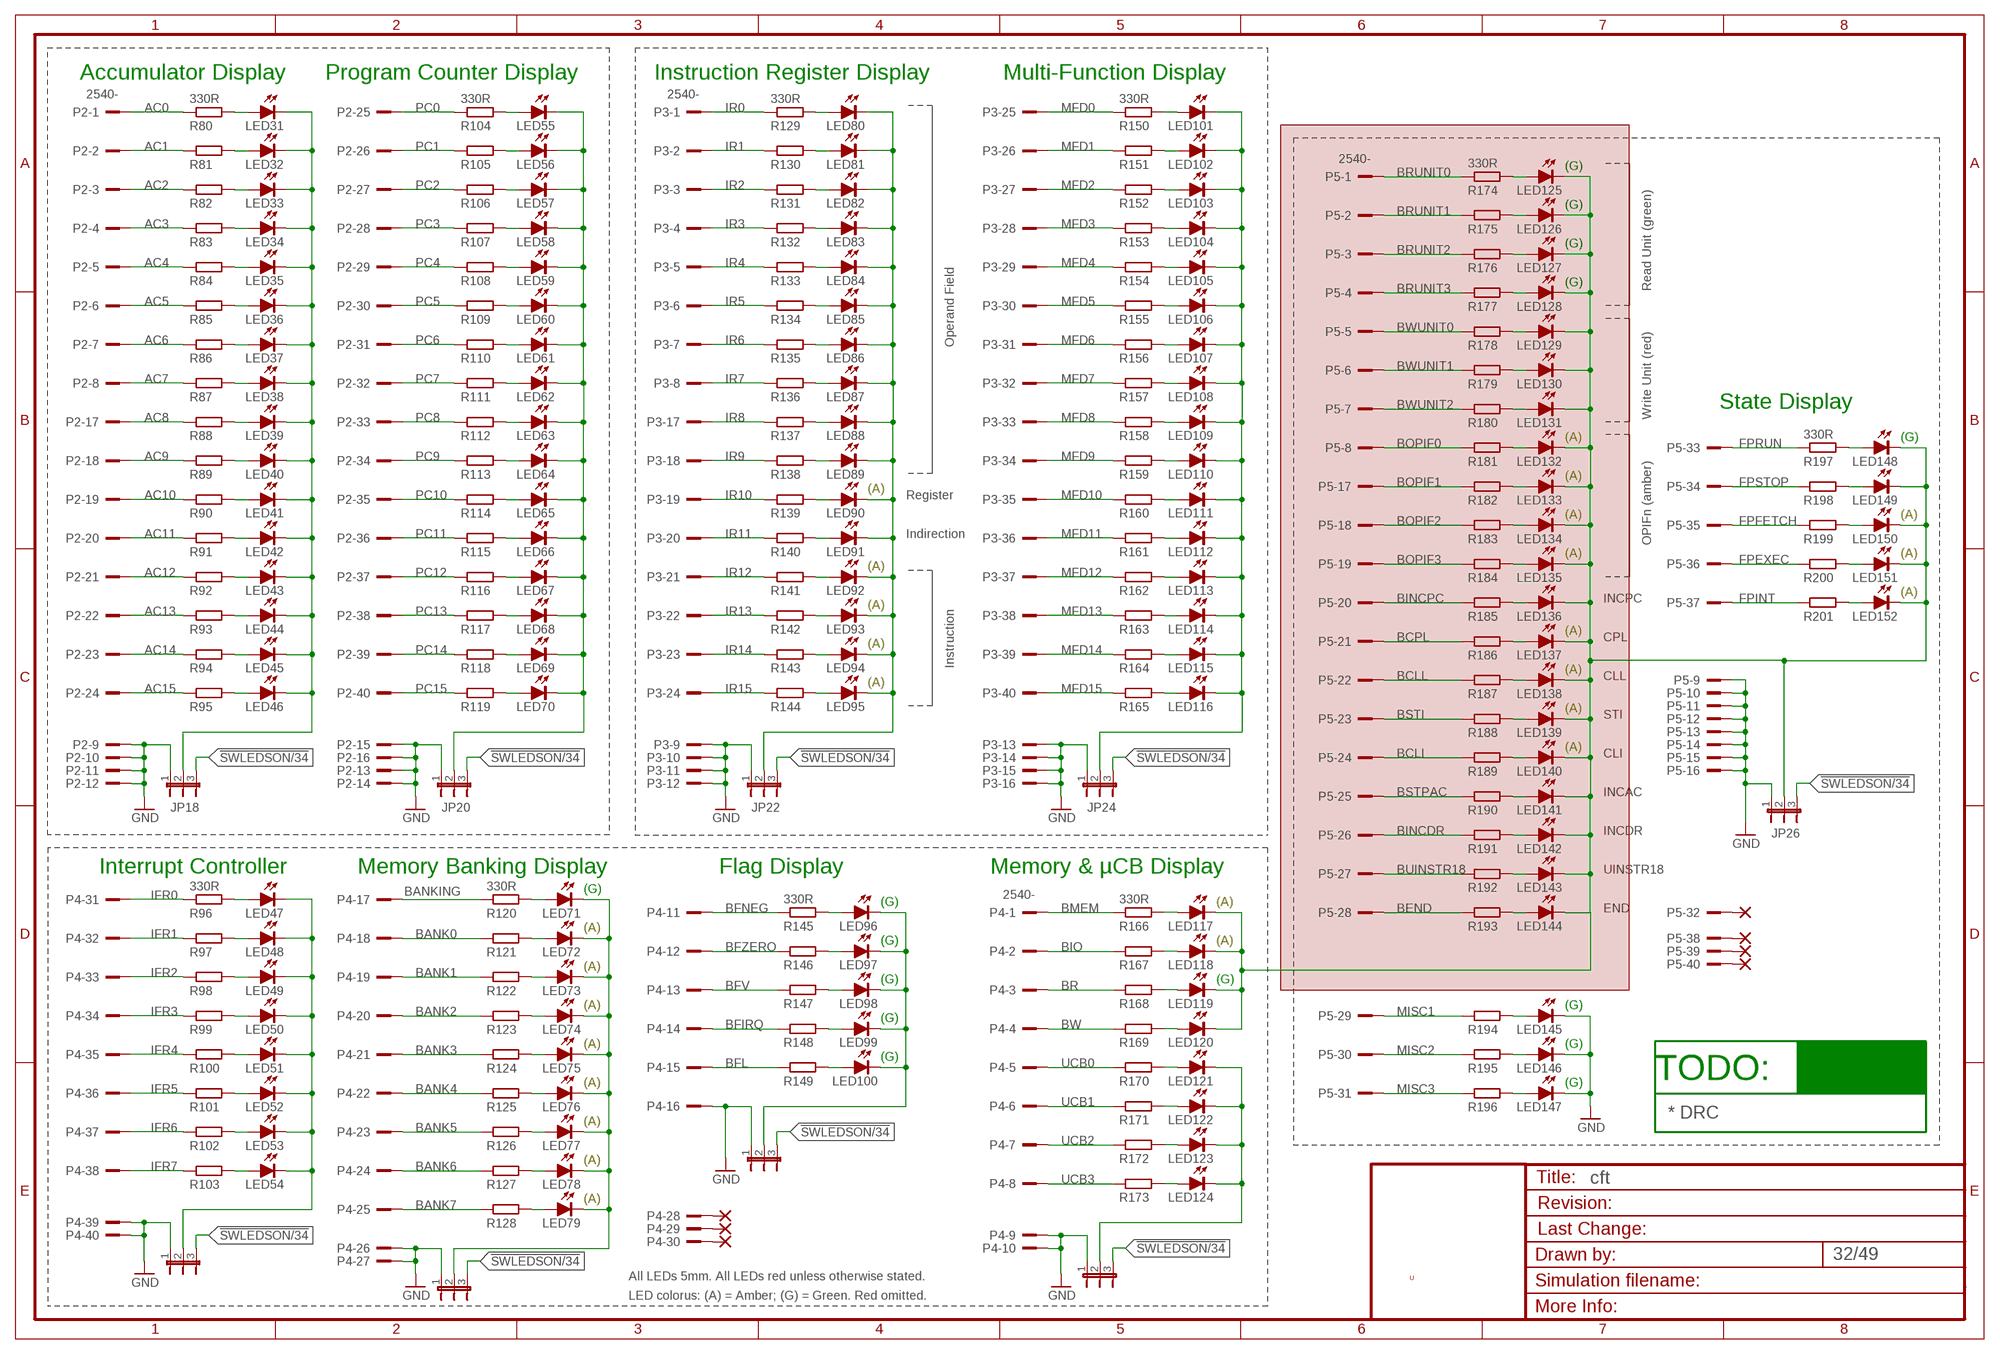
[diagram p31: schematic, sheet 32]

### Parts
JP18  JP2E  [JP2]
JP19  JP2E  [JP2]
JP20  JP2E  [JP2]
JP21  JP2E  [JP2]
JP22  JP2E  [JP2]
JP23  JP2E  [JP2]
JP24  JP2E  [JP2]
JP25  JP2E  [JP2]
JP26  JP2E  [JP2]
LED31  LED-5MM-RED  [LED5MM]
LED32  LED-5MM-RED  [LED5MM]
LED33  LED-5MM-RED  [LED5MM]
LED34  LED-5MM-RED  [LED5MM]
LED35  LED-5MM-RED  [LED5MM]
LED36  LED-5MM-RED  [LED5MM]
LED37  LED-5MM-RED  [LED5MM]
LED38  LED-5MM-RED  [LED5MM]
LED39  LED-5MM-RED  [LED5MM]
LED40  LED-5MM-RED  [LED5MM]
LED41  LED-5MM-RED  [LED5MM]
LED42  LED-5MM-RED  [LED5MM]
LED43  LED-5MM-RED  [LED5MM]
LED44  LED-5MM-RED  [LED5MM]
LED45  LED-5MM-RED  [LED5MM]
LED46  LED-5MM-RED  [LED5MM]
LED47  LED-5MM-RED  [LED5MM]
LED48  LED-5MM-RED  [LED5MM]
LED49  LED-5MM-RED  [LED5MM]
LED50  LED-5MM-RED  [LED5MM]
LED51  LED-5MM-RED  [LED5MM]
LED52  LED-5MM-RED  [LED5MM]
LED53  LED-5MM-RED  [LED5MM]
LED54  LED-5MM-RED  [LED5MM]
LED55  LED-5MM-RED  [LED5MM]
LED56  LED-5MM-RED  [LED5MM]
LED57  LED-5MM-RED  [LED5MM]
LED58  LED-5MM-RED  [LED5MM]
LED59  LED-5MM-RED  [LED5MM]
LED60  LED-5MM-RED  [LED5MM]
LED61  LED-5MM-RED  [LED5MM]
LED62  LED-5MM-RED  [LED5MM]
LED63  LED-5MM-RED  [LED5MM]
LED64  LED-5MM-RED  [LED5MM]
LED65  LED-5MM-RED  [LED5MM]
LED66  LED-5MM-RED  [LED5MM]
LED67  LED-5MM-RED  [LED5MM]
LED68  LED-5MM-RED  [LED5MM]
LED69  LED-5MM-RED  [LED5MM]
LED70  LED-5MM-RED  [LED5MM]
LED71  LED-5MM-AMBER  [LED5MM]
LED72  LED-5MM-AMBER  [LED5MM]
LED73  LED-5MM-AMBER  [LED5MM]
LED74  LED-5MM-AMBER  [LED5MM]
LED75  LED-5MM-AMBER  [LED5MM]
LED76  LED-5MM-AMBER  [LED5MM]
LED77  LED-5MM-AMBER  [LED5MM]
LED78  LED-5MM-AMBER  [LED5MM]
LED79  LED-5MM-AMBER  [LED5MM]
LED80  LED-5MM-RED  [LED5MM]
LED81  LED-5MM-RED  [LED5MM]
LED82  LED-5MM-RED  [LED5MM]
LED83  LED-5MM-RED  [LED5MM]
LED84  LED-5MM-RED  [LED5MM]
LED85  LED-5MM-RED  [LED5MM]
LED86  LED-5MM-RED  [LED5MM]
LED87  LED-5MM-RED  [LED5MM]
LED88  LED-5MM-RED  [LED5MM]
LED89  LED-5MM-RED  [LED5MM]
LED90  LED-5MM-AMBER  [LED5MM]
LED91  LED-5MM-RED  [LED5MM]
LED92  LED-5MM-AMBER  [LED5MM]
LED93  LED-5MM-AMBER  [LED5MM]
LED94  LED-5MM-AMBER  [LED5MM]
LED95  LED-5MM-AMBER  [LED5MM]
LED96  LED-5MM-AMBER  [LED5MM]
LED97  LED-5MM-AMBER  [LED5MM]
LED98  LED-5MM-AMBER  [LED5MM]
LED99  LED-5MM-AMBER  [LED5MM]
LED100  LED-5MM-AMBER  [LED5MM]
LED101  LED-5MM-RED  [LED5MM]
LED102  LED-5MM-RED  [LED5MM]
LED103  LED-5MM-RED  [LED5MM]
LED104  LED-5MM-RED  [LED5MM]
LED105  LED-5MM-RED  [LED5MM]
LED106  LED-5MM-RED  [LED5MM]
LED107  LED-5MM-RED  [LED5MM]
LED108  LED-5MM-RED  [LED5MM]
LED109  LED-5MM-RED  [LED5MM]
LED110  LED-5MM-RED  [LED5MM]
LED111  LED-5MM-RED  [LED5MM]
LED112  LED-5MM-RED  [LED5MM]
LED113  LED-5MM-RED  [LED5MM]
LED114  LED-5MM-RED  [LED5MM]
LED115  LED-5MM-RED  [LED5MM]
LED116  LED-5MM-RED  [LED5MM]
LED117  LED-5MM-AMBER  [LED5MM]
LED118  LED-5MM-AMBER  [LED5MM]
LED119  LED-5MM-AMBER  [LED5MM]
LED120  LED-5MM-RED  [LED5MM]
LED121  LED-5MM-RED  [LED5MM]
LED122  LED-5MM-RED  [LED5MM]
LED123  LED-5MM-RED  [LED5MM]
LED124  LED-5MM-RED  [LED5MM]
LED125  LED-5MM-GREEN  [LED5MM]
LED126  LED-5MM-GREEN  [LED5MM]
LED127  LED-5MM-GREEN  [LED5MM]
LED128  LED-5MM-GREEN  [LED5MM]
LED129  LED-5MM-RED  [LED5MM]
LED130  LED-5MM-RED  [LED5MM]
LED131  LED-5MM-RED  [LED5MM]
LED132  LED-5MM-AMBER  [LED5MM]
LED133  LED-5MM-AMBER  [LED5MM]
LED134  LED-5MM-AMBER  [LED5MM]
LED135  LED-5MM-AMBER  [LED5MM]
LED136  LED-5MM-RED  [LED5MM]
LED137  LED-5MM-AMBER  [LED5MM]
LED138  LED-5MM-AMBER  [LED5MM]
LED139  LED-5MM-AMBER  [LED5MM]
LED140  LED-5MM-AMBER  [LED5MM]
LED141  LED-5MM-RED  [LED5MM]
LED142  LED-5MM-RED  [LED5MM]
LED143  LED-5MM-RED  [LED5MM]
LED144  LED-5MM-AMBER  [LED5MM]
LED145  LED-5MM-AMBER  [LED5MM]
LED146  LED-5MM-AMBER  [LED5MM]
LED147  LED-5MM-AMBER  [LED5MM]
LED148  LED-5MM-RED  [LED5MM]
LED149  LED-5MM-RED  [LED5MM]
LED150  LED-5MM-AMBER  [LED5MM]
LED151  LED-5MM-RED  [LED5MM]
LED152  LED-5MM-AMBER  [LED5MM]
P2  2540-  [PAK100/2500-40]
P3  2540-  [PAK100/2500-40]
P4  2540-  [PAK100/2500-40]
P5  2540-  [PAK100/2500-40]
PAD15  1,6/0,8  [1,6/0,8]
PAD16  1,6/0,8  [1,6/0,8]
PAD17  1,6/0,8  [1,6/0,8]
PAD18  1,6/0,8  [1,6/0,8]
PAD19  1,6/0,8  [1,6/0,8]
PAD20  1,6/0,8  [1,6/0,8]
PAD21  1,6/0,8  [1,6/0,8]
R80  330R  R-EU_0204/7  [0204/7]
R81  330R  R-EU_0204/7  [0204/7]
R82  330R  R-EU_0204/7  [0204/7]
R83  330R  R-EU_0204/7  [0204/7]
R84  330R  R-EU_0204/7  [0204/7]
R85  330R  R-EU_0204/7  [0204/7]
R86  330R  R-EU_0204/7  [0204/7]
R87  330R  R-EU_0204/7  [0204/7]
R88  330R  R-EU_0204/7  [0204/7]
R89  330R  R-EU_0204/7  [0204/7]
R90  330R  R-EU_0204/7  [0204/7]
R91  330R  R-EU_0204/7  [0204/7]
R92  330R  R-EU_0204/7  [0204/7]
R93  330R  R-EU_0204/7  [0204/7]
R94  330R  R-EU_0204/7  [0204/7]
R95  330R  R-EU_0204/7  [0204/7]
R96  330R  R-EU_0204/7  [0204/7]
R97  330R  R-EU_0204/7  [0204/7]
R98  330R  R-EU_0204/7  [0204/7]
R99  330R  R-EU_0204/7  [0204/7]
R100  330R  R-EU_0204/7  [0204/7]
R101  330R  R-EU_0204/7  [0204/7]
R102  330R  R-EU_0204/7  [0204/7]
R103  330R  R-EU_0204/7  [0204/7]
R104  330R  R-EU_0204/7  [0204/7]
R105  330R  R-EU_0204/7  [0204/7]
R106  330R  R-EU_0204/7  [0204/7]
R107  330R  R-EU_0204/7  [0204/7]
R108  330R  R-EU_0204/7  [0204/7]
R109  330R  R-EU_0204/7  [0204/7]
R110  330R  R-EU_0204/7  [0204/7]
R111  330R  R-EU_0204/7  [0204/7]
R112  330R  R-EU_0204/7  [0204/7]
R113  330R  R-EU_0204/7  [0204/7]
R114  330R  R-EU_0204/7  [0204/7]
R115  330R  R-EU_0204/7  [0204/7]
R116  330R  R-EU_0204/7  [0204/7]
R117  330R  R-EU_0204/7  [0204/7]
R118  330R  R-EU_0204/7  [0204/7]
R119  330R  R-EU_0204/7  [0204/7]
R120  330R  R-EU_0204/7  [0204/7]
R121  330R  R-EU_0204/7  [0204/7]
R122  330R  R-EU_0204/7  [0204/7]
R123  330R  R-EU_0204/7  [0204/7]
R124  330R  R-EU_0204/7  [0204/7]
R125  330R  R-EU_0204/7  [0204/7]
R126  330R  R-EU_0204/7  [0204/7]
R127  330R  R-EU_0204/7  [0204/7]
R128  330R  R-EU_0204/7  [0204/7]
R129  330R  R-EU_0204/7  [0204/7]
R130  330R  R-EU_0204/7  [0204/7]
R131  330R  R-EU_0204/7  [0204/7]
R132  330R  R-EU_0204/7  [0204/7]
R133  330R  R-EU_0204/7  [0204/7]
R134  330R  R-EU_0204/7  [0204/7]
R135  330R  R-EU_0204/7  [0204/7]
R136  330R  R-EU_0204/7  [0204/7]
R137  330R  R-EU_0204/7  [0204/7]
R138  330R  R-EU_0204/7  [0204/7]
R139  330R  R-EU_0204/7  [0204/7]
R140  330R  R-EU_0204/7  [0204/7]
R141  330R  R-EU_0204/7  [0204/7]
R142  330R  R-EU_0204/7  [0204/7]
R143  330R  R-EU_0204/7  [0204/7]
R144  330R  R-EU_0204/7  [0204/7]
R145  330R  R-EU_0204/7  [0204/7]
R146  330R  R-EU_0204/7  [0204/7]
R147  330R  R-EU_0204/7  [0204/7]
R148  330R  R-EU_0204/7  [0204/7]
R149  330R  R-EU_0204/7  [0204/7]
R150  330R  R-EU_0204/7  [0204/7]
R151  330R  R-EU_0204/7  [0204/7]
R152  330R  R-EU_0204/7  [0204/7]
R153  330R  R-EU_0204/7  [0204/7]
R154  330R  R-EU_0204/7  [0204/7]
R155  330R  R-EU_0204/7  [0204/7]
R156  330R  R-EU_0204/7  [0204/7]
R157  330R  R-EU_0204/7  [0204/7]
R158  330R  R-EU_0204/7  [0204/7]
R159  330R  R-EU_0204/7  [0204/7]
R160  330R  R-EU_0204/7  [0204/7]
R161  330R  R-EU_0204/7  [0204/7]
R162  330R  R-EU_0204/7  [0204/7]
R163  330R  R-EU_0204/7  [0204/7]
R164  330R  R-EU_0204/7  [0204/7]
R165  330R  R-EU_0204/7  [0204/7]
R166  330R  R-EU_0204/7  [0204/7]
R167  330R  R-EU_0204/7  [0204/7]
R168  330R  R-EU_0204/7  [0204/7]
R169  330R  R-EU_0204/7  [0204/7]
R170  330R  R-EU_0204/7  [0204/7]
R171  330R  R-EU_0204/7  [0204/7]
R172  330R  R-EU_0204/7  [0204/7]
R173  330R  R-EU_0204/7  [0204/7]
R174  330R  R-EU_0204/7  [0204/7]
R175  330R  R-EU_0204/7  [0204/7]
R176  330R  R-EU_0204/7  [0204/7]
R177  330R  R-EU_0204/7  [0204/7]
R178  330R  R-EU_0204/7  [0204/7]
R179  330R  R-EU_0204/7  [0204/7]
R180  330R  R-EU_0204/7  [0204/7]
R181  330R  R-EU_0204/7  [0204/7]
R182  330R  R-EU_0204/7  [0204/7]
R183  330R  R-EU_0204/7  [0204/7]
R184  330R  R-EU_0204/7  [0204/7]
R185  330R  R-EU_0204/7  [0204/7]
R186  330R  R-EU_0204/7  [0204/7]
R187  330R  R-EU_0204/7  [0204/7]
R188  330R  R-EU_0204/7  [0204/7]
R189  330R  R-EU_0204/7  [0204/7]
R190  330R  R-EU_0204/7  [0204/7]
R191  330R  R-EU_0204/7  [0204/7]
R192  330R  R-EU_0204/7  [0204/7]
R193  330R  R-EU_0204/7  [0204/7]
R194  330R  R-EU_0204/7  [0204/7]
R195  330R  R-EU_0204/7  [0204/7]
R196  330R  R-EU_0204/7  [0204/7]
R197  330R  R-EU_0204/7  [0204/7]
R198  330R  R-EU_0204/7  [0204/7]
R199  330R  R-EU_0204/7  [0204/7]
R200  330R  R-EU_0204/7  [0204/7]
R201  330R  R-EU_0204/7  [0204/7]

### Nets
!SWLEDSON: JP18.3 JP19.3 JP20.3 JP21.3 JP22.3 JP23.3 JP24.3 JP25.3 JP26.3 ; also sheet 33,34
AC0: P2.1 R80.1 ; also sheet 16,19,20
AC1: P2.2 R81.1 ; also sheet 16,19,20
AC2: P2.3 R82.1 ; also sheet 16,19,20
AC3: P2.4 R83.1 ; also sheet 16,19,20
AC4: P2.5 R84.1 ; also sheet 16,19,20
AC5: P2.6 R85.1 ; also sheet 16,19,20
AC6: P2.7 R86.1 ; also sheet 16,19,20
AC7: P2.8 R87.1 ; also sheet 16,19,20
AC8: P2.17 R88.1 ; also sheet 16,19,20
AC9: P2.18 R89.1 ; also sheet 16,19,20
AC10: P2.19 R90.1 ; also sheet 16,19,20
AC11: P2.20 R91.1 ; also sheet 16,19,20
AC12: P2.21 R92.1 ; also sheet 16,19,20
AC13: P2.22 R93.1 ; also sheet 16,19,20
AC14: P2.23 R94.1 ; also sheet 16,19,20
AC15: P2.24 R95.1 ; also sheet 16,19,20
BANK0: P4.18 R121.1 ; also sheet 21
BANK1: P4.19 R122.1 ; also sheet 21
BANK2: P4.20 R123.1 ; also sheet 21
BANK3: P4.21 R124.1 ; also sheet 21
BANK4: P4.22 R125.1 ; also sheet 21
BANK5: P4.23 R126.1 ; also sheet 21
BANK6: P4.24 R127.1 ; also sheet 21
BANK7: P4.25 R128.1 ; also sheet 21
BANKING: P4.17 R120.1 ; also sheet 21
BCLI: P5.24 R189.1 ; also sheet 6,40
BCLL: P5.22 R187.1 ; also sheet 6,40
BCPL: P5.21 R186.1 ; also sheet 6,40
BEND: P5.28 R193.1 ; also sheet 6,40
BFIRQ: P4.14 R148.1 ; also sheet 6,40
BFL: P4.15 R149.1 ; also sheet 6,38,40
BFNEG: P4.11 R145.1 ; also sheet 6
BFV: P4.13 R147.1 ; also sheet 6,38,40
BFZERO: P4.12 R146.1 ; also sheet 6
BINCDR: P5.26 R191.1 ; also sheet 6,40
BINCPC: P5.20 R185.1 ; also sheet 6,40
BIO: P4.2 R167.1 ; also sheet 6,40
BMEM: P4.1 R166.1 ; also sheet 6,40
BOPIF0: P5.8 R181.1 ; also sheet 6,40
BOPIF1: P5.17 R182.1 ; also sheet 6,40
BOPIF2: P5.18 R183.1 ; also sheet 6,40
BOPIF3: P5.19 R184.1 ; also sheet 6,40
BR: P4.3 R168.1 ; also sheet 6,40
BRUNIT0: P5.1 R174.1 ; also sheet 6,40
BRUNIT1: P5.2 R175.1 ; also sheet 6,40
BRUNIT2: P5.3 R176.1 ; also sheet 6,40
BRUNIT3: P5.4 R177.1 ; also sheet 6,40
BSTI: P5.23 R188.1 ; also sheet 6,40
BSTPAC: P5.25 R190.1 ; also sheet 6,40
BUINSTR18: P5.27 R192.1 ; also sheet 40
BW: P4.4 R169.1 ; also sheet 6,40
BWUNIT0: P5.5 R178.1 ; also sheet 6,40
BWUNIT1: P5.6 R179.1 ; also sheet 6,40
BWUNIT2: P5.7 R180.1 ; also sheet 6,40
FPEXEC: P5.36 R200.1 ; also sheet 37,38
FPFETCH: P5.35 R199.1 ; also sheet 37,38,40,43
FPINT: P5.37 R201.1
FPRUN: P5.33 R197.1 ; also sheet 37,40,42,43
FPSTOP: P5.34 R198.1 ; also sheet 37,40,43
GND [low power]: JP18.1 JP19.1 JP20.1 JP21.1 JP22.1 JP23.1 JP24.1 JP25.1 JP26.1 LED145.K(C) LED146.K(C) LED147.K(C) P2.9 P2.10 P2.11 P2.12 P2.13 P2.14 P2.15 P2.16 P3.9 P3.10 P3.11 P3.12 P3.13 P3.14 P3.15 P3.16 P4.9 P4.10 P4.16 P4.26 P4.27 P4.39 P4.40 P5.9 P5.10 P5.11 P5.12 P5.13 P5.14 P5.15 P5.16 ; also sheet 2,3,4,5,6,7,8,9,10,11,12,13,14,15,16,17,18,19,20,21,22,24,25,26,27,28,29,30,31,33,34,35,36,37,38,39,40,41,42,43,44,45,46,47,48,49
IFR0: P4.31 R96.1 ; also sheet 39
IFR1: P4.32 R97.1 ; also sheet 39
IFR2: P4.33 R98.1 ; also sheet 39
IFR3: P4.34 R99.1 ; also sheet 39
IFR4: P4.35 R100.1 ; also sheet 39
IFR5: P4.36 R101.1 ; also sheet 39
IFR6: P4.37 R102.1 ; also sheet 39
IFR7: P4.38 R103.1 ; also sheet 39
IR0: P3.1 R129.1 ; also sheet 6,8,9,10,18
IR1: P3.2 R130.1 ; also sheet 8,9,10
IR2: P3.3 R131.1 ; also sheet 6,8,9,10,18
IR3: P3.4 R132.1 ; also sheet 8,9,10
IR4: P3.5 R133.1 ; also sheet 8,9,10
IR5: P3.6 R134.1 ; also sheet 8,9,10
IR6: P3.7 R135.1 ; also sheet 8,9,10
IR7: P3.8 R136.1 ; also sheet 8,9,10
IR8: P3.17 R137.1 ; also sheet 8,9,10
IR9: P3.18 R138.1 ; also sheet 8,9,10
IR10: P3.19 R139.1 ; also sheet 9,10
IR11: P3.20 R140.1 ; also sheet 4,6,10,38
IR12: P3.21 R141.1 ; also sheet 4,6,10,38
IR13: P3.22 R142.1 ; also sheet 4,6,10,38
IR14: P3.23 R143.1 ; also sheet 4,6,10,38
IR15: P3.24 R144.1 ; also sheet 4,6,10,38
MFD0: P3.25 R150.1 ; also sheet 38
MFD1: P3.26 R151.1 ; also sheet 38
MFD2: P3.27 R152.1 ; also sheet 38
MFD3: P3.28 R153.1 ; also sheet 38
MFD4: P3.29 R154.1 ; also sheet 38
MFD5: P3.30 R155.1 ; also sheet 38
MFD6: P3.31 R156.1 ; also sheet 38
MFD7: P3.32 R157.1 ; also sheet 38
MFD8: P3.33 R158.1 ; also sheet 38
MFD9: P3.34 R159.1 ; also sheet 38
MFD10: P3.35 R160.1 ; also sheet 38
MFD11: P3.36 R161.1 ; also sheet 38
MFD12: P3.37 R162.1 ; also sheet 38
MFD13: P3.38 R163.1 ; also sheet 38
MFD14: P3.39 R164.1 ; also sheet 38
MFD15: P3.40 R165.1 ; also sheet 38
MISC1: P5.29 R194.1 ; also sheet 37
MISC2: P5.30 R195.1 ; also sheet 37
MISC3: P5.31 R196.1 ; also sheet 37
N$323 [low power]: JP20.2 LED55.K(C) LED56.K(C) LED57.K(C) LED58.K(C) LED59.K(C) LED60.K(C) LED61.K(C) LED62.K(C) LED63.K(C) LED64.K(C) LED65.K(C) LED66.K(C) LED67.K(C) LED68.K(C) LED69.K(C) LED70.K(C)
N$324 [low power]: JP18.2 LED31.K(C) LED32.K(C) LED33.K(C) LED34.K(C) LED35.K(C) LED36.K(C) LED37.K(C) LED38.K(C) LED39.K(C) LED40.K(C) LED41.K(C) LED42.K(C) LED43.K(C) LED44.K(C) LED45.K(C) LED46.K(C)
N$325: LED126.A R175.2
N$326: LED34.A R83.2
N$327: LED97.A R146.2
N$328: LED125.A R174.2
N$329 [low power]: JP19.2 LED47.K(C) LED48.K(C) LED49.K(C) LED50.K(C) LED51.K(C) LED52.K(C) LED53.K(C) LED54.K(C)
N$330: LED47.A R96.2
N$411 [low power]: JP24.2 LED101.K(C) LED102.K(C) LED103.K(C) LED104.K(C) LED105.K(C) LED106.K(C) LED107.K(C) LED108.K(C) LED109.K(C) LED110.K(C) LED111.K(C) LED112.K(C) LED113.K(C) LED114.K(C) LED115.K(C) LED116.K(C)
N$412: LED33.A R82.2
N$413: LED32.A R81.2
N$414: LED31.A R80.2
N$415: LED37.A R86.2
N$416: LED36.A R85.2
N$449: LED35.A R84.2
N$450: P4.28 PAD15.1(P)
N$451: LED119.A R168.2
N$468 [low power]: JP25.2 LED121.K(C) LED122.K(C) LED123.K(C) LED124.K(C)
N$470: P5.38 PAD19.1(P)
N$471: P5.39 PAD20.1(P)
N$472: P5.40 PAD21.1(P)
N$473: P5.32 PAD18.1(P)
N$474: P4.29 PAD16.1(P)
N$475: P4.30 PAD17.1(P)
N$477: LED40.A R89.2
N$478: LED39.A R88.2
N$587: LED38.A R87.2
N$588: LED43.A R92.2
N$589: LED42.A R91.2
N$590: LED41.A R90.2
N$591: LED46.A R95.2
N$592: LED45.A R94.2
N$593: LED44.A R93.2
N$594: LED58.A R107.2
N$595: LED57.A R106.2
N$596: LED56.A R105.2
N$597: LED55.A R104.2
N$598: LED61.A R110.2
N$599: LED60.A R109.2
N$600: LED59.A R108.2
N$601: LED64.A R113.2
N$602: LED63.A R112.2
N$603: LED62.A R111.2
N$604: LED67.A R116.2
N$605: LED66.A R115.2
N$606: LED65.A R114.2
N$607: LED70.A R119.2
N$608: LED69.A R118.2
N$609: LED68.A R117.2
N$610 [low power]: JP22.2 LED80.K(C) LED81.K(C) LED82.K(C) LED83.K(C) LED84.K(C) LED85.K(C) LED86.K(C) LED87.K(C) LED88.K(C) LED89.K(C) LED90.K(C) LED91.K(C) LED92.K(C) LED93.K(C) LED94.K(C) LED95.K(C)
N$611: LED83.A R132.2
N$612: LED82.A R131.2
N$613: LED81.A R130.2
N$614: LED80.A R129.2
N$615: LED86.A R135.2
N$616: LED85.A R134.2
N$617: LED84.A R133.2
N$618: LED89.A R138.2
N$619: LED88.A R137.2
N$620: LED87.A R136.2
N$621: LED92.A R141.2
N$622: LED91.A R140.2
N$623: LED90.A R139.2
N$624: LED95.A R144.2
N$625: LED94.A R143.2
N$626: LED93.A R142.2
N$627: LED104.A R153.2
N$628: LED103.A R152.2
N$629: LED102.A R151.2
N$630: LED107.A R156.2
N$631: LED106.A R155.2
N$632: LED105.A R154.2
N$633: LED110.A R159.2
N$634: LED109.A R158.2
N$635: LED108.A R157.2
N$636: LED113.A R162.2
N$637: LED112.A R161.2
N$638: LED111.A R160.2
N$639: LED116.A R165.2
N$640: LED115.A R164.2
N$641: LED114.A R163.2
N$642: LED101.A R150.2
N$643: LED48.A R97.2
N$644: LED49.A R98.2
N$645: LED50.A R99.2
N$646: LED51.A R100.2
N$647: LED52.A R101.2
N$648: LED53.A R102.2
N$649: LED54.A R103.2
N$658: JP26.2 LED117.K(C) LED118.K(C) LED119.K(C) LED120.K(C) LED125.K(C) LED126.K(C) LED127.K(C) LED128.K(C) LED129.K(C) LED130.K(C) LED131.K(C) LED132.K(C) LED133.K(C) LED134.K(C) LED135.K(C) LED136.K(C) LED137.K(C) LED138.K(C) LED139.K(C) LED140.K(C) LED141.K(C) LED142.K(C) LED143.K(C) LED144.K(C) LED148.K(C) LED149.K(C) LED150.K(C) LED151.K(C) LED152.K(C)
N$659: LED71.A R120.2
N$660: LED72.A R121.2
N$661: LED73.A R122.2
N$662: LED74.A R123.2
N$663: LED75.A R124.2
N$664: LED76.A R125.2
N$665: LED77.A R126.2
N$666: LED78.A R127.2
N$667: LED79.A R128.2
N$668 [low power]: JP21.2 LED71.K(C) LED72.K(C) LED73.K(C) LED74.K(C) LED75.K(C) LED76.K(C) LED77.K(C) LED78.K(C) LED79.K(C)
N$669: LED96.A R145.2
N$670: LED98.A R147.2
N$671: LED99.A R148.2
N$672: LED100.A R149.2
N$674 [low power]: JP23.2 LED96.K(C) LED97.K(C) LED98.K(C) LED99.K(C) LED100.K(C)
N$676: LED117.A R166.2
N$677: LED118.A R167.2
N$796: LED120.A R169.2
N$797: LED121.A R170.2
N$798: LED122.A R171.2
N$799: LED123.A R172.2
N$800: LED124.A R173.2
N$802: LED127.A R176.2
N$803: LED128.A R177.2
N$804: LED129.A R178.2
N$805: LED130.A R179.2
N$806: LED131.A R180.2
N$807: LED132.A R181.2
N$808: LED134.A R183.2
N$809: LED133.A R182.2
N$810: LED135.A R184.2
N$811: LED136.A R185.2
N$812: LED137.A R186.2
N$813: LED138.A R187.2
N$814: LED139.A R188.2
N$815: LED140.A R189.2
N$816: LED142.A R191.2
N$817: LED141.A R190.2
N$818: LED143.A R192.2
N$819: LED144.A R193.2
N$820: LED145.A R194.2
N$821: LED146.A R195.2
N$822: LED147.A R196.2
N$823: LED148.A R197.2
N$824: LED150.A R199.2
N$825: LED152.A R201.2
N$826: LED149.A R198.2
N$827: LED151.A R200.2
PC0: P2.25 R104.1 ; also sheet 14
PC1: P2.26 R105.1 ; also sheet 14
PC2: P2.27 R106.1 ; also sheet 14
PC3: P2.28 R107.1 ; also sheet 14
PC4: P2.29 R108.1 ; also sheet 14
PC5: P2.30 R109.1 ; also sheet 14
PC6: P2.31 R110.1 ; also sheet 14
PC7: P2.32 R111.1 ; also sheet 14
PC8: P2.33 R112.1 ; also sheet 14
PC9: P2.34 R113.1 ; also sheet 14
PC10: P2.35 R114.1 ; also sheet 6,9,14
PC11: P2.36 R115.1 ; also sheet 6,9,14
PC12: P2.37 R116.1 ; also sheet 6,9,14
PC13: P2.38 R117.1 ; also sheet 6,9,14
PC14: P2.39 R118.1 ; also sheet 6,9,14
PC15: P2.40 R119.1 ; also sheet 6,9,14
UCB0: P4.5 R170.1 ; also sheet 4
UCB1: P4.6 R171.1 ; also sheet 4
UCB2: P4.7 R172.1 ; also sheet 4
UCB3: P4.8 R173.1 ; also sheet 4

### Notes on the sheet
- Accumulator Display | Program Counter Display | Instruction Register Display | Multi-Function Display
- (G)
- Read Unit (green)
- (G)
- (G)
- Operand Field
- (G)
- Write Unit (red)
- State Display
- (A) | (G)
- OPIFn (amber)
- (A)
- (A)
- Register
- (A) | (A)
- Indirection
- (A) | (A)
- (A)
- (A)
- INCPC
- (A) | Instruction
- (A)
- CPL
- (A)
- (A)
- CLL
- (A)
- (A)
- STI
- (A)
- CLI
- INCAC
- INCDR
- Interrupt Controller | Memory Banking Display | Flag Display | Memory & µCB Display | UINSTR18
- (G)
- (G) | (A)
- END
- (A)
- (G) | (A)
- (A)
- (G) | (G)
- (A) | (G)
- (G)
- (A) | (G)
- (G)
- TODO:
- (A) | (G)
- * DRC
- (A)
- (A)
- (A)
- All LEDs 5mm. All LEDs red unless otherwise stated. | U
- LED colorus: (A) = Amber; (G) = Green. Red omitted.

## Sheet 33 of 49
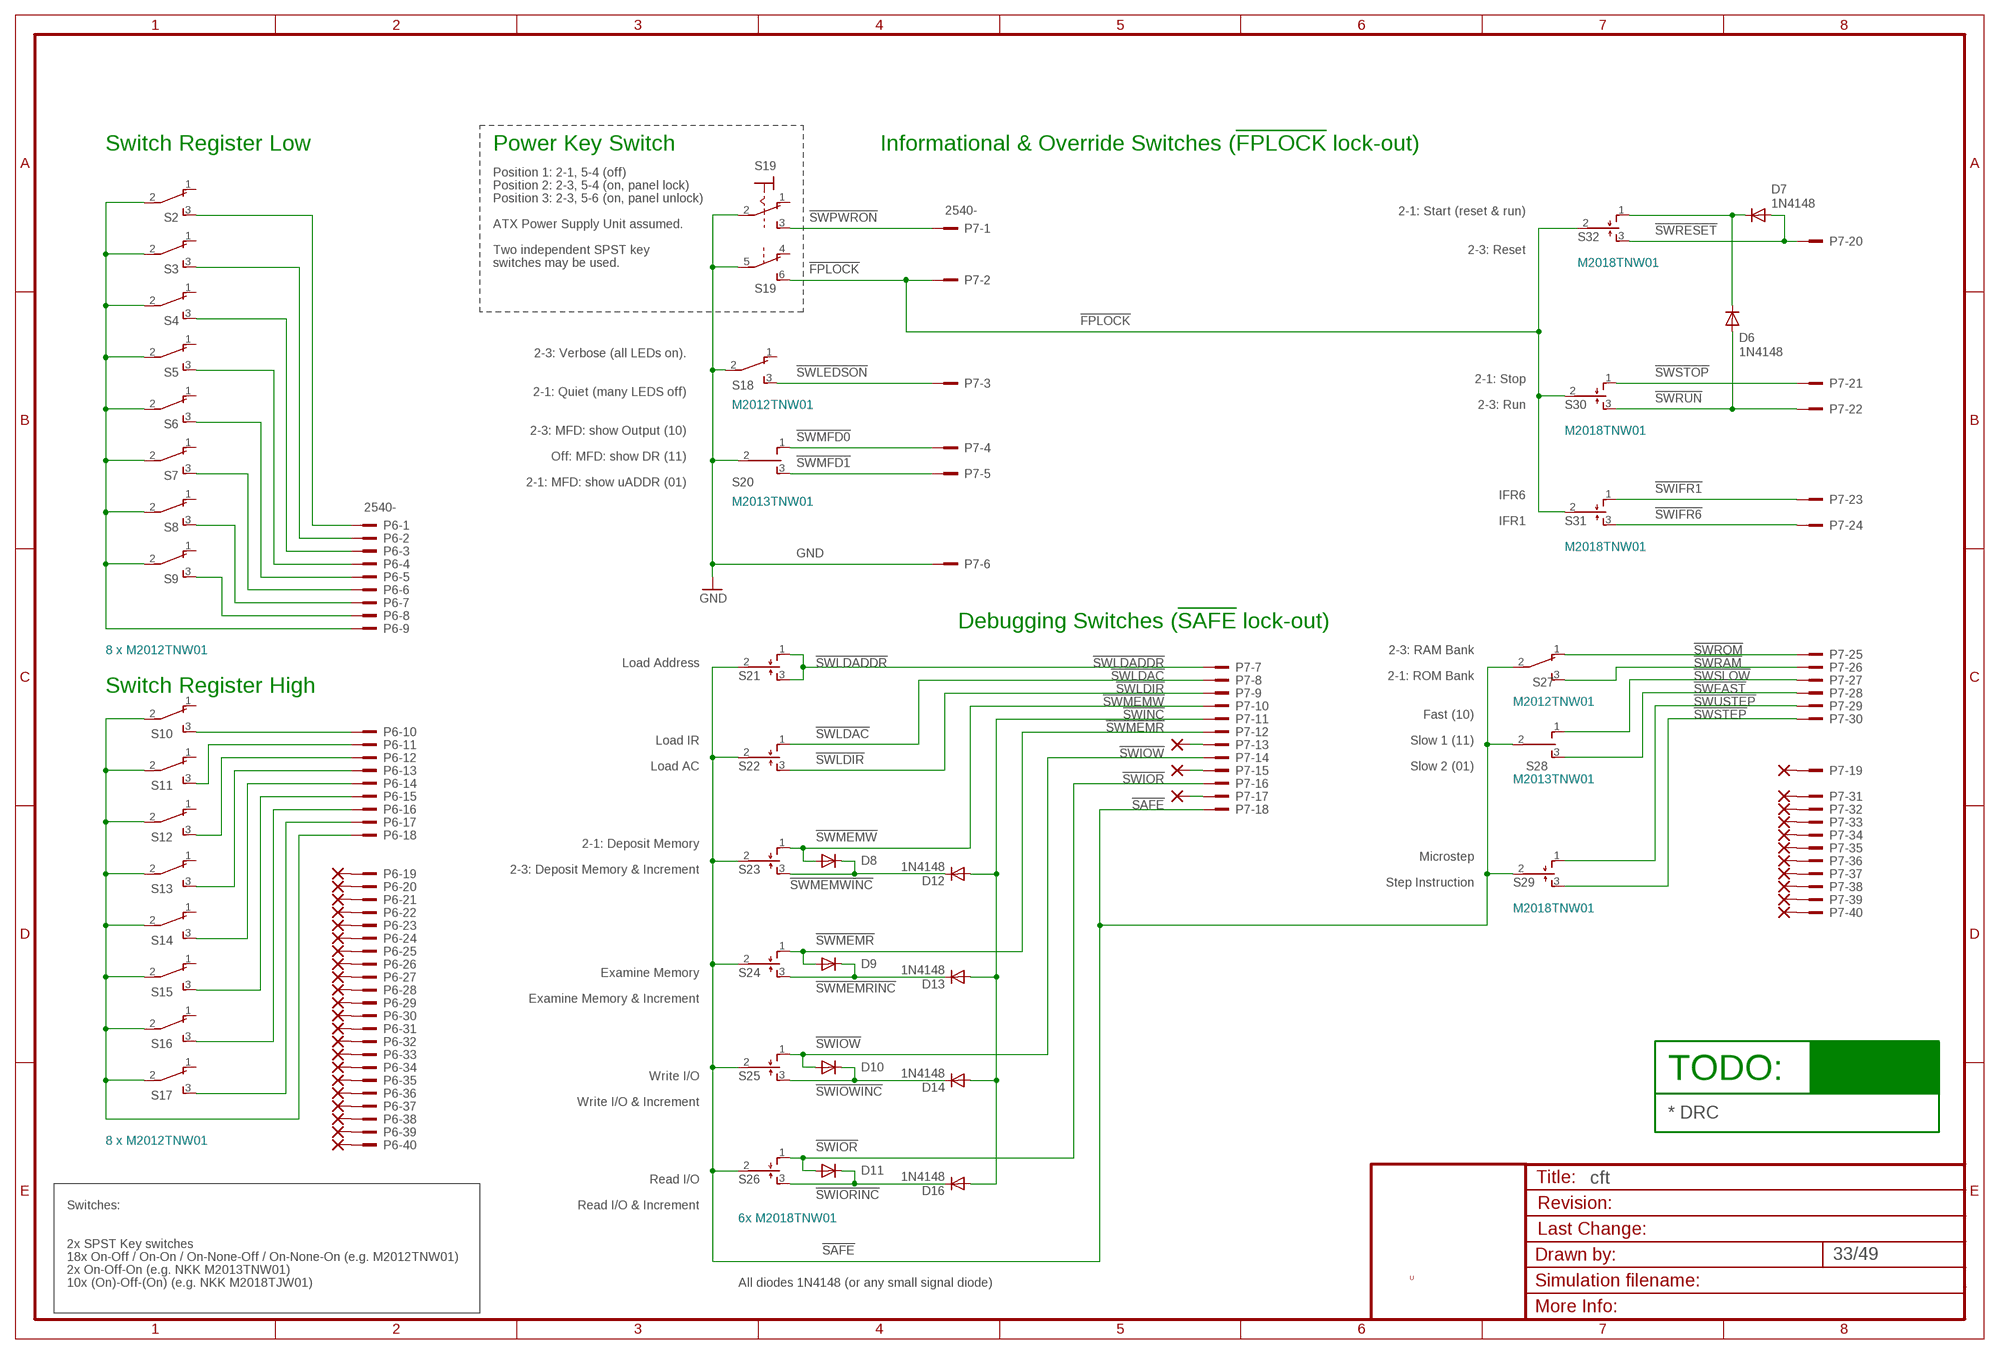
[diagram p32: schematic, sheet 33]

### Parts
D6  1N4148  1N4148DO35-7  [DO35-7]
D7  1N4148  1N4148DO35-7  [DO35-7]
D8  1N4148  1N4148DO35-7  [DO35-7]
D9  1N4148  1N4148DO35-7  [DO35-7]
D10  1N4148  1N4148DO35-7  [DO35-7]
D11  1N4148  1N4148DO35-7  [DO35-7]
D12  1N4148  1N4148DO35-7  [DO35-7]
D13  1N4148  1N4148DO35-7  [DO35-7]
D14  1N4148  1N4148DO35-7  [DO35-7]
D16  1N4148  1N4148DO35-7  [DO35-7]
P6  2540-  [PAK100/2500-40]
P7  2540-  [PAK100/2500-40]
PAD22  1,6/0,8  [1,6/0,8]
PAD23  1,6/0,8  [1,6/0,8]
PAD24  1,6/0,8  [1,6/0,8]
PAD25  1,6/0,8  [1,6/0,8]
PAD26  1,6/0,8  [1,6/0,8]
PAD27  1,6/0,8  [1,6/0,8]
PAD28  1,6/0,8  [1,6/0,8]
PAD29  1,6/0,8  [1,6/0,8]
PAD30  1,6/0,8  [1,6/0,8]
PAD31  1,6/0,8  [1,6/0,8]
PAD32  1,6/0,8  [1,6/0,8]
PAD33  1,6/0,8  [1,6/0,8]
PAD34  1,6/0,8  [1,6/0,8]
PAD35  1,6/0,8  [1,6/0,8]
PAD36  1,6/0,8  [1,6/0,8]
PAD37  1,6/0,8  [1,6/0,8]
PAD38  1,6/0,8  [1,6/0,8]
PAD39  1,6/0,8  [1,6/0,8]
PAD40  1,6/0,8  [1,6/0,8]
PAD41  1,6/0,8  [1,6/0,8]
PAD42  1,6/0,8  [1,6/0,8]
PAD43  1,6/0,8  [1,6/0,8]
PAD44  1,6/0,8  [1,6/0,8]
PAD45  1,6/0,8  [1,6/0,8]
PAD46  1,6/0,8  [1,6/0,8]
PAD47  1,6/0,8  [1,6/0,8]
PAD48  1,6/0,8  [1,6/0,8]
PAD49  1,6/0,8  [1,6/0,8]
PAD50  1,6/0,8  [1,6/0,8]
PAD51  1,6/0,8  [1,6/0,8]
PAD52  1,6/0,8  [1,6/0,8]
PAD53  1,6/0,8  [1,6/0,8]
PAD54  1,6/0,8  [1,6/0,8]
PAD55  1,6/0,8  [1,6/0,8]
PAD56  1,6/0,8  [1,6/0,8]
PAD57  1,6/0,8  [1,6/0,8]
S2  TL36PO  [TL3XPO]
S3  TL36PO  [TL3XPO]
S4  TL36PO  [TL3XPO]
S5  TL36PO  [TL3XPO]
S6  TL36PO  [TL3XPO]
S7  TL36PO  [TL3XPO]
S8  TL36PO  [TL3XPO]
S9  TL36PO  [TL3XPO]
S10  TL36PO  [TL3XPO]
S11  TL36PO  [TL3XPO]
S12  TL36PO  [TL3XPO]
S13  TL36PO  [TL3XPO]
S14  TL36PO  [TL3XPO]
S15  TL36PO  [TL3XPO]
S16  TL36PO  [TL3XPO]
S17  TL36PO  [TL3XPO]
S18  TL36PO  [TL3XPO]
S19  320-938  [320-938]
S20  TL39PO  [TL3XPO]
S21  TL37PO  [TL3XPO]
S22  TL37PO  [TL3XPO]
S23  TL37PO  [TL3XPO]
S24  TL37PO  [TL3XPO]
S25  TL37PO  [TL3XPO]
S26  TL37PO  [TL3XPO]
S27  TL36PO  [TL3XPO]
S28  TL39PO  [TL3XPO]
S29  TL37PO  [TL3XPO]
S30  TL37PO  [TL3XPO]
S31  TL37PO  [TL3XPO]
S32  TL37PO  [TL3XPO]

### Nets
!FPLOCK: P7.2 S19.6(B:S) S30.2(P) S31.2(P) S32.2(P) ; also sheet 34,35
!SAFE: P7.18 S21.2(P) S22.2(P) S23.2(P) S24.2(P) S25.2(P) S26.2(P) S27.2(P) S28.2(P) S29.2(P) ; also sheet 34,35
!SWFAST: P7.28 S28.3(S) ; also sheet 34
!SWIFR1: P7.23 S31.1(O)
!SWIFR6: P7.24 S31.3(S)
!SWINC: D12.A D13.A D14.A D16.A
!SWIOR: D11.A P7.16 S26.1(O)
!SWIORINC: D11.C D16.C S26.3(S)
!SWIOW: D10.A P7.14 S25.1(O)
!SWIOWINC: D10.C D14.C S25.3(S)
!SWLDAC: P7.8 S22.1(O)
!SWLDADDR: P7.7 S21.1(O) S21.3(S)
!SWLDIR: P7.9 S22.3(S)
!SWLEDSON: P7.3 S18.3(S) ; also sheet 32,34
!SWMEMR: D9.A P7.12 S24.1(O)
!SWMEMRINC: D9.C D13.C S24.3(S)
!SWMEMW: D8.A P7.10 S23.1(O)
!SWMEMWINC: D8.C D12.C S23.3(S)
!SWMFD0: P7.4 S20.1(O)
!SWMFD1: P7.5 S20.3(S)
!SWPWRON: P7.1 S19.3(1:S)
!SWRAM: P7.26 S27.3(S) ; also sheet 34
!SWRESET: D7.A P7.20 S32.3(S)
!SWROM: P7.25 S27.1(O) ; also sheet 34
!SWRUN: D6.A P7.22 S30.3(S)
!SWSLOW: P7.27 S28.1(O) ; also sheet 34
!SWSTEP: P7.30 S29.3(S) ; also sheet 34
!SWSTOP: P7.21 S30.1(O)
!SWUSTEP: P7.29 S29.1(O) ; also sheet 34
GND [low power]: P7.6 S18.2(P) S19.2(1:P) S19.5(B:P) S20.2(P) ; also sheet 2,3,4,5,6,7,8,9,10,11,12,13,14,15,16,17,18,19,20,21,22,24,25,26,27,28,29,30,31,32,34,35,36,37,38,39,40,41,42,43,44,45,46,47,48,49
N$52: P7.13 PAD45.1(P)
N$113: P7.15 PAD46.1(P)
N$115: P7.17 PAD57.1(P)
N$153: P7.19 PAD44.1(P)
N$476: P6.2 S3.3(S)
N$479: P6.3 S4.3(S)
N$480: P6.4 S5.3(S)
N$489: P6.5 S6.3(S)
N$490: P6.6 S7.3(S)
N$491: P6.7 S8.3(S)
N$492: P6.8 S9.3(S)
N$493: P6.10 S10.3(S)
N$494: P6.11 S11.3(S)
N$495: P6.12 S12.3(S)
N$496: P6.13 S13.3(S)
N$498: P6.14 S14.3(S)
N$499: P6.15 S15.3(S)
N$500: P6.16 S16.3(S)
N$501: P6.17 S17.3(S)
N$549: P6.1 S2.3(S)
N$550 [low power]: P6.9 S2.2(P) S3.2(P) S4.2(P) S5.2(P) S6.2(P) S7.2(P) S8.2(P) S9.2(P)
N$551 [low power]: P6.18 S10.2(P) S11.2(P) S12.2(P) S13.2(P) S14.2(P) S15.2(P) S16.2(P) S17.2(P)
N$552: P6.19 PAD22.1(P)
N$553: P6.20 PAD23.1(P)
N$554: P6.21 PAD24.1(P)
N$555: P6.22 PAD25.1(P)
N$556: P6.23 PAD26.1(P)
N$557: P6.24 PAD27.1(P)
N$558: P6.25 PAD28.1(P)
N$559: P6.26 PAD29.1(P)
N$560: P6.27 PAD30.1(P)
N$561: P6.28 PAD31.1(P)
N$562: P6.29 PAD32.1(P)
N$563: P6.30 PAD33.1(P)
N$564: P6.31 PAD34.1(P)
N$565: P6.32 PAD35.1(P)
N$566: P6.33 PAD36.1(P)
N$567: P6.34 PAD37.1(P)
N$568: P6.35 PAD38.1(P)
N$569: P6.36 PAD39.1(P)
N$570: P6.37 PAD40.1(P)
N$571: P6.38 PAD41.1(P)
N$572: P6.39 PAD42.1(P)
N$573: P6.40 PAD43.1(P)
N$574: D6.C D7.C S32.1(O)
N$577: P7.31 PAD47.1(P)
N$578: P7.32 PAD48.1(P)
N$579: P7.33 PAD49.1(P)
N$580: P7.34 PAD50.1(P)
N$581: P7.35 PAD51.1(P)
N$582: P7.36 PAD52.1(P)
N$583: P7.37 PAD53.1(P)
N$584: P7.38 PAD54.1(P)
N$585: P7.39 PAD55.1(P)
N$586: P7.40 PAD56.1(P)
Unconnected: P7.11 S2.1(O) S3.1(O) S4.1(O) S5.1(O) S6.1(O) S7.1(O) S8.1(O) S9.1(O) S10.1(O) S11.1(O) S12.1(O) S13.1(O) S14.1(O) S15.1(O) S16.1(O) S17.1(O) S18.1(O) S19.1(1:O) S19.4(B:O)

### Notes on the sheet
- Switch Register Low | Power Key Switch | Informational & Override Switches (!FPLOCK! lock-out)
- Position 1: 2-1, 5-4 (off)
- Position 2: 2-3, 5-4 (on, panel lock)
- Position 3: 2-3, 5-6 (on, panel unlock)
- 2-1: Start (reset & run)
- ATX Power Supply Unit assumed.
- Two independent SPST key | 2-3: Reset
- switches may be used. | M2018TNW01
- 2-3: Verbose (all LEDs on).
- 2-1: Stop
- 2-1: Quiet (many LEDS off)
- M2012TNW01 | 2-3: Run
- 2-3: MFD: show Output (10) | M2018TNW01
- Off: MFD: show DR (11)
- 2-1: MFD: show uADDR (01)
- IFR6
- M2013TNW01
- IFR1
- M2018TNW01
- Debugging Switches (!SAFE! lock-out)
- 8 x M2012TNW01 | 2-3: RAM Bank
- Load Address
- 2-1: ROM Bank
- Switch Register High
- M2012TNW01
- Fast (10)
- Load IR | Slow 1 (11)
- Load AC | Slow 2 (01)
- M2013TNW01
- 2-1: Deposit Memory
- Microstep
- 2-3: Deposit Memory & Increment
- Step Instruction
- M2018TNW01
- Examine Memory
- Examine Memory & Increment
- Write I/O | TODO:
- Write I/O & Increment
- * DRC
- 8 x M2012TNW01
- Read I/O
- Switches: | Read I/O & Increment
- 6x M2018TNW01
- 2x SPST Key switches
- 18x On-Off / On-On / On-None-Off / On-None-On (e.g. M2012TNW01)
- 2x On-Off-On (e.g. NKK M2013TNW01)
- U
- 10x (On)-Off-(On) (e.g. NKK M2018TJW01) | All diodes 1N4148 (or any small signal diode)